# Altium project mwh618.prjpcb (part 1 of 2)
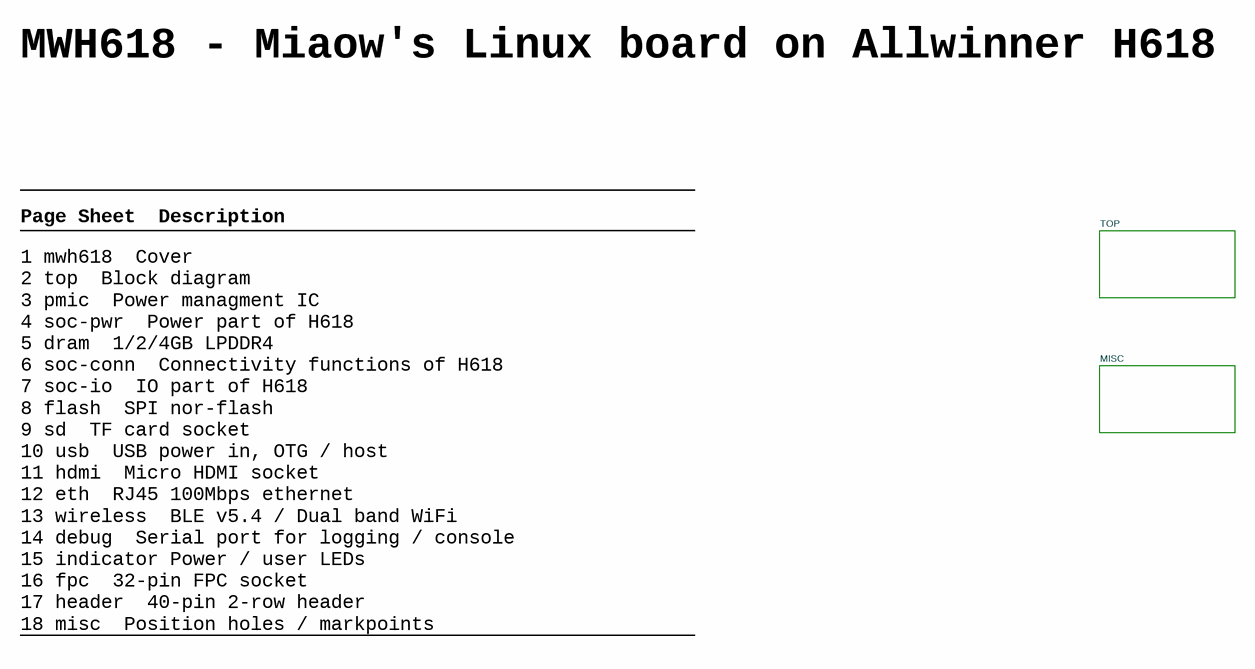
[diagram p0: mwh618.schdoc]
Board: MWH618; License: CERN-OHL-S-2.0 license; Sample: A0; Url: github.com/miaow-cn/mwh618-hw
18 sheets, 304 parts. Net scope: hierarchical (ports join the sheet entries above them; power ports are global).
Board file: mwh618.pcbdoc
Sheets:
  mwh618.schdoc
    TOP = top.schdoc
      LPDDR4 = dram.schdoc
      HDMI = hdmi.schdoc
      PMIC = pmic.schdoc
      SOC-CONN = soc-conn.schdoc
      SOC-PWR = soc-pwr.schdoc
      USB = usb.schdoc
      SOC-IO = soc-io.schdoc
      DEBUG = debug.schdoc
      ETH = eth.schdoc
      SD = sd.schdoc
      FLASH = flash.schdoc
      WIRELESS = wireless.schdoc
      FPC = fpc.schdoc
      HEADER = header.schdoc
      INDICATOR = indicator.schdoc
    MISC = misc.schdoc

## Sheet mwh618.schdoc: MWH618
size A4; Date: 02.10.2025; CheckedBy: BCY; DrawnBy: miaow; Revision: v1.0.0; SheetNumber: 1; SheetTotal: 18; BoardType: MAIN_PCB; Desc: miaow's h618 linux development board

### Sub-sheets
MISC = misc.schdoc: no entries
TOP = top.schdoc: no entries

### Notes on the sheet
- MWH618 - Miaow's Linux board on Allwinner H618
- Page	Sheet		Description
- 1	mwh618		Cover
  2	top		Block diagram
  3	pmic		Power managment IC
  4	soc-pwr		Power part of H618
  5	dram		1/2/4GB LPDDR4
  6	soc-conn		Connectivity functions of H618
  7	soc-io		IO part of H618
  8	flash		SPI nor-flash
  9	sd		TF card socket
  10	usb		USB power in, OTG / host
  11	hdmi		Micro HDMI socket
  12	eth		RJ45 100Mbps ethernet
  13	wireless		BLE v5.4 / Dual band WiFi
  14	debug		Serial port for logging / console
  15	indicator	Power / user LEDs
  16	fpc		32-pin FPC socket
  17	header		40-pin 2-row header
  18	misc		Position holes / markpoints
- DRAWN
- CHECKED
- DRAWNBY
- SHEETS
- SHEETS_NO

## Sheet top.schdoc: MWH618
size A4; Date: 10.01.2026; CheckedBy: BCY; DrawnBy: miaow; Revision: v1.0.0; SheetNumber: 2; SheetTotal: 17; BoardType: MAIN_PCB; Desc: the top level sch
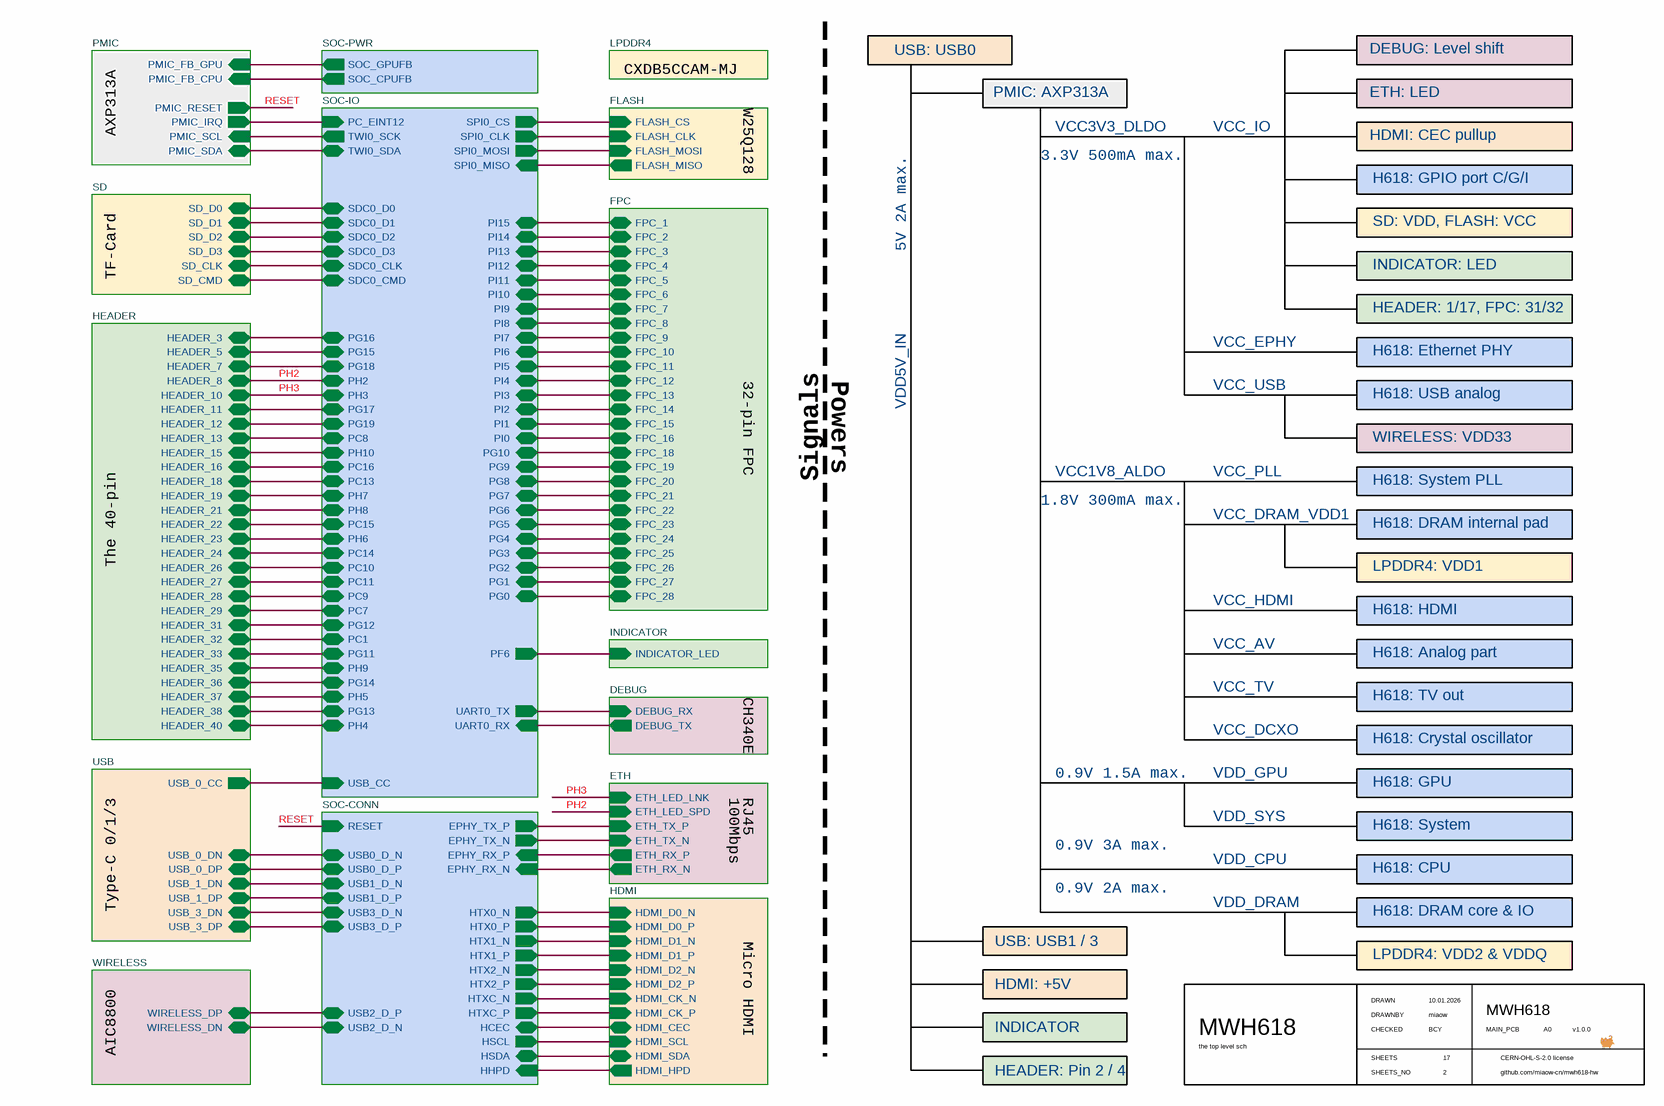
[diagram p1: top.schdoc]

### Sub-sheets
DEBUG = debug.schdoc: DEBUG_TX (out), DEBUG_RX (in)
ETH = eth.schdoc: ETH_TX_P (in), ETH_TX_N (in), ETH_RX_N (out), ETH_RX_P (out), ETH_LED_SPD (in), ETH_LED_LNK (in)
FLASH = flash.schdoc: FLASH_CS (in), FLASH_MISO (out), FLASH_MOSI (in), FLASH_CLK (in)
FPC = fpc.schdoc: FPC_4 (bidir), FPC_5 (bidir), FPC_6 (bidir), FPC_7 (bidir), FPC_8 (bidir), FPC_9 (bidir), FPC_10 (bidir), FPC_11 (bidir), FPC_12 (bidir), FPC_13 (bidir), FPC_14 (bidir), FPC_15 (bidir), FPC_16 (bidir), FPC_22 (bidir), FPC_23 (bidir), FPC_24 (bidir), FPC_25 (bidir), FPC_26 (bidir), FPC_27 (bidir), FPC_28 (bidir), FPC_1 (bidir), FPC_3 (bidir), FPC_2 (bidir), FPC_18 (bidir), FPC_19 (bidir), FPC_20 (bidir), FPC_21 (bidir)
HDMI = hdmi.schdoc: HDMI_D0_N (in), HDMI_D0_P (in), HDMI_D1_N (in), HDMI_D1_P (in), HDMI_D2_N (in), HDMI_D2_P (in), HDMI_CEC (bidir), HDMI_SCL (in), HDMI_SDA (bidir), HDMI_HPD (out), HDMI_CK_N (in), HDMI_CK_P (in)
HEADER = header.schdoc: HEADER_3 (bidir), HEADER_5 (bidir), HEADER_7 (bidir), HEADER_8 (bidir), HEADER_10 (bidir), HEADER_11 (bidir), HEADER_12 (bidir), HEADER_13 (bidir), HEADER_15 (bidir), HEADER_16 (bidir), HEADER_18 (bidir), HEADER_19 (bidir), HEADER_21 (bidir), HEADER_22 (bidir), HEADER_23 (bidir), HEADER_24 (bidir), HEADER_26 (bidir), HEADER_27 (bidir), HEADER_28 (bidir), HEADER_29 (bidir), HEADER_31 (bidir), HEADER_32 (bidir), HEADER_33 (bidir), HEADER_35 (bidir), HEADER_36 (bidir), HEADER_37 (bidir), HEADER_38 (bidir), HEADER_40 (bidir)
INDICATOR = indicator.schdoc: INDICATOR_LED (in)
LPDDR4 = dram.schdoc: no entries
PMIC = pmic.schdoc: PMIC_FB_GPU (in), PMIC_FB_CPU (in), PMIC_SDA (bidir), PMIC_SCL (in), PMIC_IRQ (out), PMIC_RESET (out)
SD = sd.schdoc: SD_D0 (bidir), SD_D1 (bidir), SD_CLK (bidir), SD_D2 (bidir), SD_D3 (bidir), SD_CMD (bidir)
SOC-CONN = soc-conn.schdoc: HHPD (in), HSDA (bidir), HSCL (out), HCEC (bidir), HTXC_P (out), HTXC_N (out), HTX2_P (out), HTX2_N (out), HTX1_P (out), HTX1_N (out), HTX0_P (out), HTX0_N (out), EPHY_RX_N (in), EPHY_RX_P (in), EPHY_TX_N (out), EPHY_TX_P (out), USB2_D_P (bidir), USB2_D_N (bidir), USB3_D_P (bidir), USB3_D_N (bidir), USB1_D_P (bidir), USB1_D_N (bidir), USB0_D_P (bidir), USB0_D_N (bidir), RESET (in)
SOC-IO = soc-io.schdoc: UART0_RX (in), UART0_TX (out), PC_EINT12 (in), TWI0_SDA (bidir), TWI0_SCK (out), SDC0_D1 (bidir), SDC0_D2 (bidir), SDC0_D0 (bidir), SDC0_D3 (bidir), SDC0_CLK (bidir), SDC0_CMD (bidir), PG16 (bidir), PG15 (bidir), PG18 (bidir), PG17 (bidir), PG19 (bidir), PC8 (bidir), PH10 (bidir), PC16 (bidir), PC13 (bidir), PH7 (bidir), PH8 (bidir), PC15 (bidir), PH6 (bidir), PC14 (bidir), PC10 (bidir), PC11 (bidir), PC9 (bidir), PC7 (bidir), PG12 (bidir), USB_CC (in), PF6 (out), PC1 (bidir), PG11 (bidir), PH9 (bidir), PG14 (bidir), PH5 (bidir), PG13 (bidir), PH4 (bidir), SPI0_CS (out), SPI0_CLK (out), SPI0_MOSI (out), SPI0_MISO (in), PI15 (bidir), PI14 (bidir), PI13 (bidir), PI12 (bidir), PI11 (bidir), PI10 (bidir), PI9 (bidir), PI8 (bidir), PI7 (bidir), PI6 (bidir), PI4 (bidir), PI5 (bidir), PI3 (bidir), PI2 (bidir), PI1 (bidir), PI0 (bidir), PG10 (bidir), PG9 (bidir), PG8 (bidir), PG7 (bidir), PG6 (bidir), PG5 (bidir), PG4 (bidir), PG0 (bidir), PG3 (bidir), PG2 (bidir), PG1 (bidir), PH2 (bidir), PH3 (bidir)
SOC-PWR = soc-pwr.schdoc: SOC_GPUFB (out), SOC_CPUFB (out)
USB = usb.schdoc: USB_0_DN (bidir), USB_0_DP (bidir), USB_1_DN (bidir), USB_1_DP (bidir), USB_3_DN (bidir), USB_3_DP (bidir), USB_0_CC (out)
WIRELESS = wireless.schdoc: WIRELESS_DN (bidir), WIRELESS_DP (bidir)

### Nets
_H_3: sheet SOC-IO/PG16, sheet HEADER/HEADER_3
_H_5: sheet SOC-IO/PG15, sheet HEADER/HEADER_5
_H_7: sheet SOC-IO/PG18, sheet HEADER/HEADER_7
_H_11: sheet SOC-IO/PG17, sheet HEADER/HEADER_11
_H_12: sheet SOC-IO/PG19, sheet HEADER/HEADER_12
_H_13: sheet SOC-IO/PC8, sheet HEADER/HEADER_13
_H_15: sheet SOC-IO/PH10, sheet HEADER/HEADER_15
_H_16: sheet SOC-IO/PC16, sheet HEADER/HEADER_16
_H_18: sheet SOC-IO/PC13, sheet HEADER/HEADER_18
_H_19: sheet SOC-IO/PH7, sheet HEADER/HEADER_19
_H_21: sheet SOC-IO/PH8, sheet HEADER/HEADER_21
_H_22: sheet SOC-IO/PC15, sheet HEADER/HEADER_22
_H_23: sheet SOC-IO/PH6, sheet HEADER/HEADER_23
_H_24: sheet SOC-IO/PC14, sheet HEADER/HEADER_24
_H_26: sheet SOC-IO/PC10, sheet HEADER/HEADER_26
_H_27: sheet SOC-IO/PC11, sheet HEADER/HEADER_27
_H_28: sheet SOC-IO/PC9, sheet HEADER/HEADER_28
_H_29: sheet SOC-IO/PC7, sheet HEADER/HEADER_29
_H_31: sheet SOC-IO/PG12, sheet HEADER/HEADER_31
_H_32: sheet SOC-IO/PC1, sheet HEADER/HEADER_32
_H_33: sheet SOC-IO/PG11, sheet HEADER/HEADER_33
_H_35: sheet SOC-IO/PH9, sheet HEADER/HEADER_35
_H_36: sheet SOC-IO/PG14, sheet HEADER/HEADER_36
_H_37: sheet SOC-IO/PH5, sheet HEADER/HEADER_37
_H_38: sheet SOC-IO/PG13, sheet HEADER/HEADER_38
_H_40: sheet SOC-IO/PH4, sheet HEADER/HEADER_40
DEBUG_RX: sheet SOC-IO/UART0_TX, sheet DEBUG/DEBUG_RX
DEBUG_TX: sheet SOC-IO/UART0_RX, sheet DEBUG/DEBUG_TX
EPHY_RX_N: sheet SOC-CONN/EPHY_RX_N, sheet ETH/ETH_RX_N
EPHY_RX_P: sheet SOC-CONN/EPHY_RX_P, sheet ETH/ETH_RX_P
EPHY_TX_N: sheet SOC-CONN/EPHY_TX_N, sheet ETH/ETH_TX_N
EPHY_TX_P: sheet SOC-CONN/EPHY_TX_P, sheet ETH/ETH_TX_P
FLASH_CLK: sheet SOC-IO/SPI0_CLK, sheet FLASH/FLASH_CLK
FLASH_CS: sheet SOC-IO/SPI0_CS, sheet FLASH/FLASH_CS
FLASH_MISO: sheet SOC-IO/SPI0_MISO, sheet FLASH/FLASH_MISO
FLASH_MOSI: sheet SOC-IO/SPI0_MOSI, sheet FLASH/FLASH_MOSI
FPC_1: sheet SOC-IO/PI15, sheet FPC/FPC_1
FPC_2: sheet SOC-IO/PI14, sheet FPC/FPC_2
FPC_3: sheet SOC-IO/PI13, sheet FPC/FPC_3
FPC_4: sheet SOC-IO/PI12, sheet FPC/FPC_4
FPC_5: sheet SOC-IO/PI11, sheet FPC/FPC_5
FPC_6: sheet SOC-IO/PI10, sheet FPC/FPC_6
FPC_7: sheet SOC-IO/PI9, sheet FPC/FPC_7
FPC_8: sheet SOC-IO/PI8, sheet FPC/FPC_8
FPC_9: sheet SOC-IO/PI7, sheet FPC/FPC_9
FPC_10: sheet SOC-IO/PI6, sheet FPC/FPC_10
FPC_11: sheet SOC-IO/PI5, sheet FPC/FPC_11
FPC_12: sheet SOC-IO/PI4, sheet FPC/FPC_12
FPC_13: sheet SOC-IO/PI3, sheet FPC/FPC_13
FPC_14: sheet SOC-IO/PI2, sheet FPC/FPC_14
FPC_15: sheet SOC-IO/PI1, sheet FPC/FPC_15
FPC_16: sheet SOC-IO/PI0, sheet FPC/FPC_16
FPC_18: sheet SOC-IO/PG10, sheet FPC/FPC_18
FPC_19: sheet SOC-IO/PG9, sheet FPC/FPC_19
FPC_20: sheet SOC-IO/PG8, sheet FPC/FPC_20
FPC_21: sheet SOC-IO/PG7, sheet FPC/FPC_21
FPC_22: sheet SOC-IO/PG6, sheet FPC/FPC_22
FPC_23: sheet SOC-IO/PG5, sheet FPC/FPC_23
FPC_24: sheet SOC-IO/PG4, sheet FPC/FPC_24
FPC_25: sheet SOC-IO/PG3, sheet FPC/FPC_25
FPC_26: sheet SOC-IO/PG2, sheet FPC/FPC_26
FPC_27: sheet SOC-IO/PG1, sheet FPC/FPC_27
FPC_28: sheet SOC-IO/PG0, sheet FPC/FPC_28
HCEC: sheet HDMI/HDMI_CEC, sheet SOC-CONN/HCEC
HDMI_CK_N: sheet HDMI/HDMI_CK_N, sheet SOC-CONN/HTXC_N
HDMI_CK_P: sheet HDMI/HDMI_CK_P, sheet SOC-CONN/HTXC_P
HDMI_D0_N: sheet HDMI/HDMI_D0_N, sheet SOC-CONN/HTX0_N
HDMI_D0_P: sheet HDMI/HDMI_D0_P, sheet SOC-CONN/HTX0_P
HDMI_D1_N: sheet HDMI/HDMI_D1_N, sheet SOC-CONN/HTX1_N
HDMI_D1_P: sheet HDMI/HDMI_D1_P, sheet SOC-CONN/HTX1_P
HDMI_D2_N: sheet HDMI/HDMI_D2_N, sheet SOC-CONN/HTX2_N
HDMI_D2_P: sheet HDMI/HDMI_D2_P, sheet SOC-CONN/HTX2_P
HDMI_HPD: sheet HDMI/HDMI_HPD, sheet SOC-CONN/HHPD
HDMI_SCL: sheet HDMI/HDMI_SCL, sheet SOC-CONN/HSCL
HDMI_SDA: sheet HDMI/HDMI_SDA, sheet SOC-CONN/HSDA
INDICATOR_LED: sheet SOC-IO/PF6, sheet INDICATOR/INDICATOR_LED
PC_EINT12: sheet PMIC/PMIC_IRQ, sheet SOC-IO/PC_EINT12
PH2: sheet SOC-IO/PH2, sheet ETH/ETH_LED_SPD, sheet HEADER/HEADER_8
PH3: sheet SOC-IO/PH3, sheet ETH/ETH_LED_LNK, sheet HEADER/HEADER_10
PMIC_FB_CPU: sheet PMIC/PMIC_FB_CPU, sheet SOC-PWR/SOC_CPUFB
PMIC_FB_GPU: sheet PMIC/PMIC_FB_GPU, sheet SOC-PWR/SOC_GPUFB
PMIC_SCL: sheet PMIC/PMIC_SCL, sheet SOC-IO/TWI0_SCK
PMIC_SDA: sheet PMIC/PMIC_SDA, sheet SOC-IO/TWI0_SDA
RESET: sheet PMIC/PMIC_RESET, sheet SOC-CONN/RESET
SD_CLK: sheet SOC-IO/SDC0_CLK, sheet SD/SD_CLK
SD_CMD: sheet SOC-IO/SDC0_CMD, sheet SD/SD_CMD
SD_D0: sheet SOC-IO/SDC0_D0, sheet SD/SD_D0
SD_D1: sheet SOC-IO/SDC0_D1, sheet SD/SD_D1
SD_D2: sheet SOC-IO/SDC0_D2, sheet SD/SD_D2
SD_D3: sheet SOC-IO/SDC0_D3, sheet SD/SD_D3
USB0_D_N: sheet SOC-CONN/USB0_D_N, sheet USB/USB_0_DN
USB0_D_P: sheet SOC-CONN/USB0_D_P, sheet USB/USB_0_DP
USB1_D_N: sheet SOC-CONN/USB1_D_N, sheet USB/USB_1_DN
USB1_D_P: sheet SOC-CONN/USB1_D_P, sheet USB/USB_1_DP
USB2_D_N: sheet SOC-CONN/USB2_D_N, sheet WIRELESS/WIRELESS_DN
USB2_D_P: sheet SOC-CONN/USB2_D_P, sheet WIRELESS/WIRELESS_DP
USB3_D_N: sheet SOC-CONN/USB3_D_N, sheet USB/USB_3_DN
USB3_D_P: sheet SOC-CONN/USB3_D_P, sheet USB/USB_3_DP
USB_0_CC: sheet USB/USB_0_CC, sheet SOC-IO/USB_CC

### Notes on the sheet
- CXDB5CCAM-MJ
- W25Q128
- USB: USB0
- PMIC: AXP313A
- ETH: LED
- DEBUG: Level shift
- AXP313A
- 3.3V 500mA max.
- VCC3V3_DLDO
- VCC_IO
- HDMI: CEC pullup
- H618: GPIO port C/G/I
- 5V 2A max.
- SD: VDD, FLASH: VCC
- TF-Card
- INDICATOR: LED
- HEADER: 1/17, FPC: 31/32
- 32-pin FPC
- Powers
- VDD5V_IN
- VCC_EPHY
- VCC_USB
- H618: USB analog
- H618: Ethernet PHY
- Signals
- VCC1V8_ALDO
- VCC_PLL
- WIRELESS: VDD33
- 1.8V 300mA max.
- VCC_DRAM_VDD1
- H618: System PLL
- H618: DRAM internal pad
- The 40-pin
- VCC_HDMI
- H618: HDMI
- LPDDR4: VDD1
- CH340E
- VCC_AV
- VCC_TV
- H618: Analog part
- VCC_DCXO
- H618: TV out
- H618: Crystal oscillator
- 100Mbps
- RJ45
- 0.9V 1.5A max.
- VDD_GPU
- VDD_SYS
- H618: System
- H618: GPU
- Type-C 0/1/3
- 0.9V 3A max.
- 0.9V 2A max.
- VDD_CPU
- VDD_DRAM
- H618: CPU
- Micro HDMI
- USB: USB1 / 3
- H618: DRAM core & IO
- LPDDR4: VDD2 & VDDQ
- AIC8800
- HDMI: +5V
- INDICATOR
- HEADER: Pin 2 / 4
- DRAWN
- CHECKED
- DRAWNBY
- SHEETS
- SHEETS_NO

## Sheet dram.schdoc: DRAM
size A4; Date: 02.10.2025; CheckedBy: BCY; DrawnBy: miaow; Revision: v1.0.0; SheetNumber: 5; SheetTotal: 17; BoardType: MAIN_PCB; Desc: LPDDR4
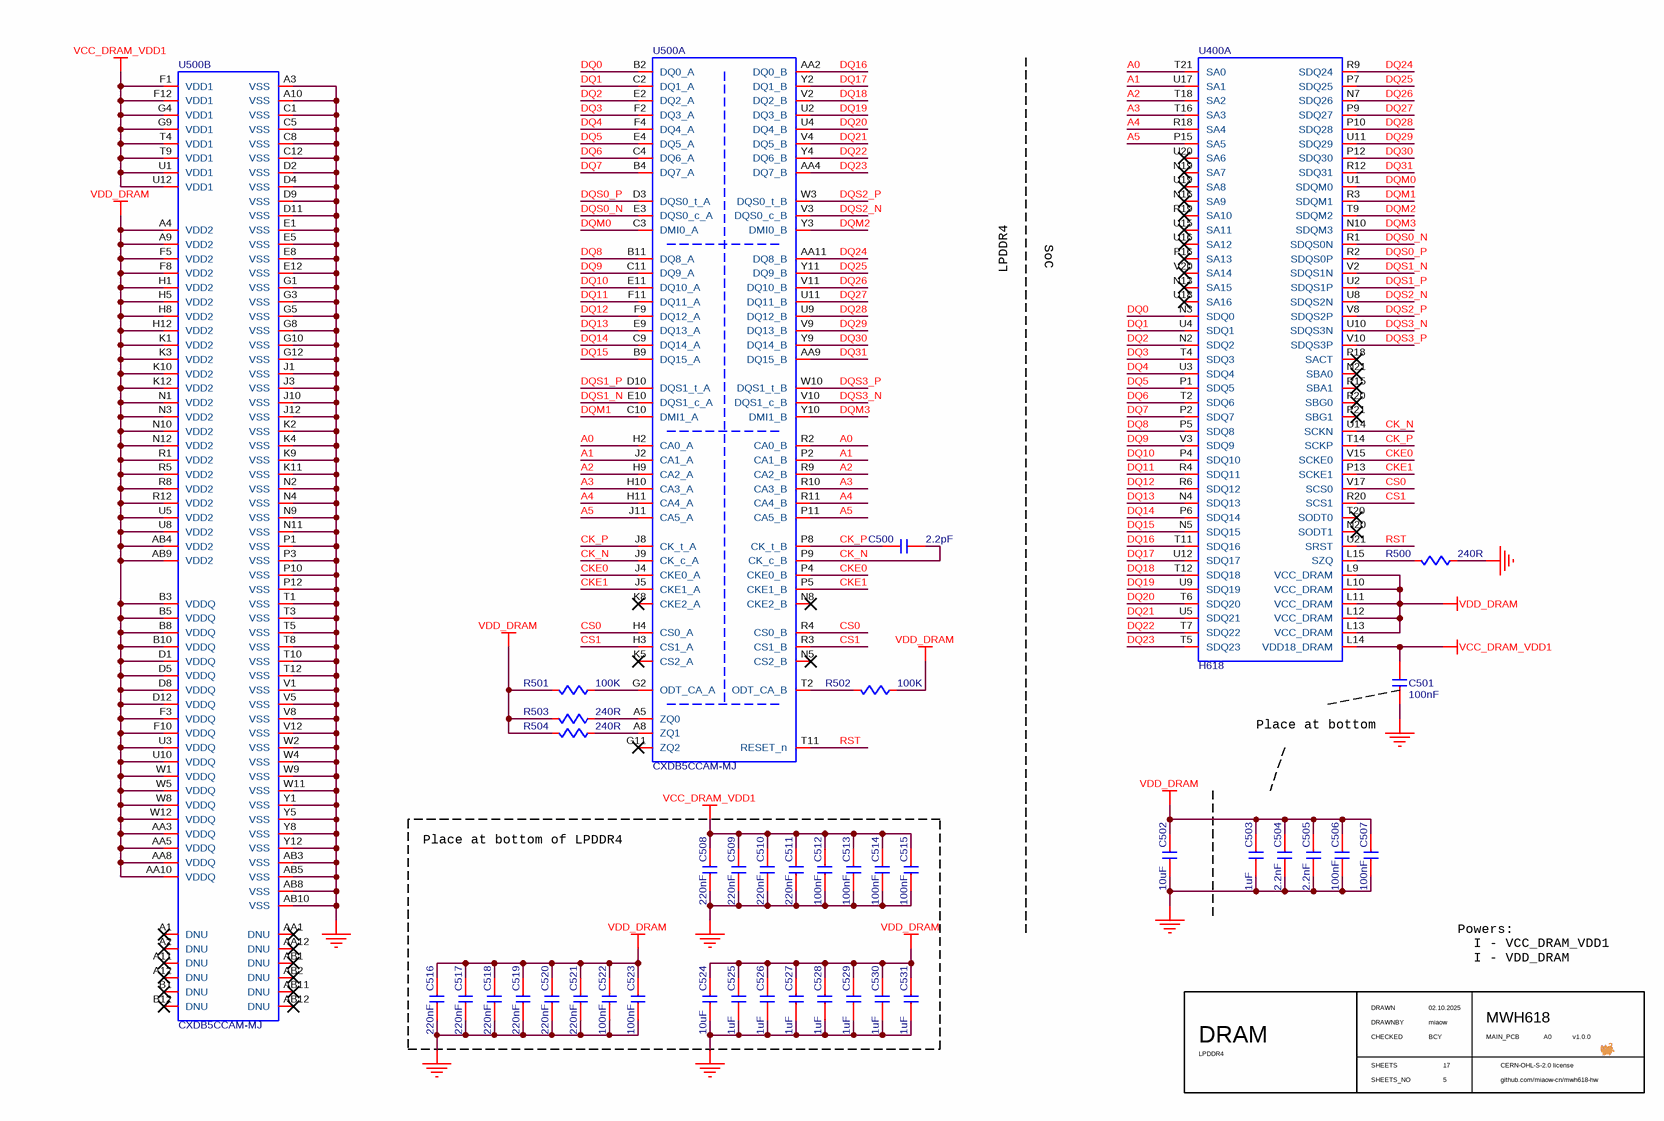
[diagram p2: dram.schdoc]

### Parts
C500  value 2.2pF  [C0201]  (hidden comment: C-NOMO)
C501  value 100nF  [C0201]  (hidden comment: C-NOMO)
C502  value 10uF  [C0402]  (hidden comment: C-NOMO)
C503  value 1uF  [C0201]  (hidden comment: C-NOMO)
C504  value 2.2nF  [C0201]  (hidden comment: C-NOMO)
C505  value 2.2nF  [C0201]  (hidden comment: C-NOMO)
C506  value 100nF  [C0201]  (hidden comment: C-NOMO)
C507  value 100nF  [C0201]  (hidden comment: C-NOMO)
C508  value 220nF  [C0201]  (hidden comment: C-NOMO)
C509  value 220nF  [C0201]  (hidden comment: C-NOMO)
C510  value 220nF  [C0201]  (hidden comment: C-NOMO)
C511  value 220nF  [C0201]  (hidden comment: C-NOMO)
C512  value 100nF  [C0201]  (hidden comment: C-NOMO)
C513  value 100nF  [C0201]  (hidden comment: C-NOMO)
C514  value 100nF  [C0201]  (hidden comment: C-NOMO)
C515  value 100nF  [C0201]  (hidden comment: C-NOMO)
C516  value 220nF  [C0201]  (hidden comment: C-NOMO)
C517  value 220nF  [C0201]  (hidden comment: C-NOMO)
C518  value 220nF  [C0201]  (hidden comment: C-NOMO)
C519  value 220nF  [C0201]  (hidden comment: C-NOMO)
C520  value 220nF  [C0201]  (hidden comment: C-NOMO)
C521  value 220nF  [C0201]  (hidden comment: C-NOMO)
C522  value 100nF  [C0201]  (hidden comment: C-NOMO)
C523  value 100nF  [C0201]  (hidden comment: C-NOMO)
C524  value 10uF  [C0402]  (hidden comment: C-NOMO)
C525  value 1uF  [C0201]  (hidden comment: C-NOMO)
C526  value 1uF  [C0201]  (hidden comment: C-NOMO)
C527  value 1uF  [C0201]  (hidden comment: C-NOMO)
C528  value 1uF  [C0201]  (hidden comment: C-NOMO)
C529  value 1uF  [C0201]  (hidden comment: C-NOMO)
C530  value 1uF  [C0201]  (hidden comment: C-NOMO)
C531  value 1uF  [C0201]  (hidden comment: C-NOMO)
R500  value 240R  [R0402]  (hidden comment: R)
R501  value 100K  [R0402]  (hidden comment: R)
R502  value 100K  [R0402]  (hidden comment: R)
R503  value 240R  [R0402]  (hidden comment: R)
R504  value 240R  [R0402]  (hidden comment: R)
U400  H618  [H618]  (part A of 4)
U500  CXDB5CCAM-MJ  [CXDB5CCAM-MJ]  (parts A,B of 2)

### Blocks framed on the sheet
Place at bottom of LPDDR4: C508-C531

### Nets
GND: C501.1 C502.1 C503.1 C504.1 C505.1 C506.1 C507.1 C508.1 C509.1 C510.1 C511.1 C512.1 C513.1 C514.1 C515.1 C516.1 C517.1 C518.1 C519.1 C520.1 C521.1 C522.1 C523.1 C524.1 C525.1 C526.1 C527.1 C528.1 C529.1 C530.1 C531.1 R500.2 U500.A3(VSS) U500.A10(VSS) U500.AB3(VSS) U500.AB5(VSS) U500.AB8(VSS) U500.AB10(VSS) U500.C1(VSS) U500.C5(VSS) U500.C8(VSS) U500.C12(VSS) U500.D2(VSS) U500.D4(VSS) U500.D9(VSS) U500.D11(VSS) U500.E1(VSS) U500.E5(VSS) U500.E8(VSS) U500.E12(VSS) U500.G1(VSS) U500.G3(VSS) U500.G5(VSS) U500.G8(VSS) U500.G10(VSS) U500.G12(VSS) U500.J1(VSS) U500.J3(VSS) U500.J10(VSS) U500.J12(VSS) U500.K2(VSS) U500.K4(VSS) U500.K9(VSS) U500.K11(VSS) U500.N2(VSS) U500.N4(VSS) U500.N9(VSS) U500.N11(VSS) U500.P1(VSS) U500.P3(VSS) U500.P10(VSS) U500.P12(VSS) U500.T1(VSS) U500.T3(VSS) U500.T5(VSS) U500.T8(VSS) U500.T10(VSS) U500.T12(VSS) U500.V1(VSS) U500.V5(VSS) U500.V8(VSS) U500.V12(VSS) U500.W2(VSS) U500.W4(VSS) U500.W9(VSS) U500.W11(VSS) U500.Y1(VSS) U500.Y5(VSS) U500.Y8(VSS) U500.Y12(VSS)
VCC_DRAM_VDD1: C501.2 C508.2 C509.2 C510.2 C511.2 C512.2 C513.2 C514.2 C515.2 U400.L14(VDD18_DRAM) U500.F1(VDD1) U500.F12(VDD1) U500.G4(VDD1) U500.G9(VDD1) U500.T4(VDD1) U500.T9(VDD1) U500.U1(VDD1) U500.U12(VDD1)  [project net VCC1V8_ALDO]
VDD_DRAM: C502.2 C503.2 C504.2 C505.2 C506.2 C507.2 C516.2 C517.2 C518.2 C519.2 C520.2 C521.2 C522.2 C523.2 C524.2 C525.2 C526.2 C527.2 C528.2 C529.2 C530.2 C531.2 R501.1 R502.2 R503.1 R504.1 U400.L9(VCC_DRAM) U400.L10(VCC_DRAM) U400.L11(VCC_DRAM) U400.L12(VCC_DRAM) U400.L13(VCC_DRAM) U500.A4(VDD2) U500.A9(VDD2) U500.AA3(VDDQ) U500.AA5(VDDQ) U500.AA8(VDDQ) U500.AA10(VDDQ) U500.AB4(VDD2) U500.AB9(VDD2) U500.B3(VDDQ) U500.B5(VDDQ) U500.B8(VDDQ) U500.B10(VDDQ) U500.D1(VDDQ) U500.D5(VDDQ) U500.D8(VDDQ) U500.D12(VDDQ) U500.F3(VDDQ) U500.F5(VDD2) U500.F8(VDD2) U500.F10(VDDQ) U500.H1(VDD2) U500.H5(VDD2) U500.H8(VDD2) U500.H12(VDD2) U500.K1(VDD2) U500.K3(VDD2) U500.K10(VDD2) U500.K12(VDD2) U500.N1(VDD2) U500.N3(VDD2) U500.N10(VDD2) U500.N12(VDD2) U500.R1(VDD2) U500.R5(VDD2) U500.R8(VDD2) U500.R12(VDD2) U500.U3(VDDQ) U500.U5(VDD2) U500.U8(VDD2) U500.U10(VDDQ) U500.W1(VDDQ) U500.W5(VDDQ) U500.W8(VDDQ) U500.W12(VDDQ)
A0: U400.T21(SA0) U500.H2(CA0_A) U500.R2(CA0_B)
A1: U400.U17(SA1) U500.J2(CA1_A) U500.P2(CA1_B)
A2: U400.T18(SA2) U500.H9(CA2_A) U500.R9(CA2_B)
A3: U400.T16(SA3) U500.H10(CA3_A) U500.R10(CA3_B)
A4: U400.R18(SA4) U500.H11(CA4_A) U500.R11(CA4_B)
A5: U400.P15(SA5) U500.J11(CA5_A) U500.P11(CA5_B)
CK_N: C500.1 U400.U14(SCKN) U500.J9(CK_c_A) U500.P9(CK_c_B)
CK_P: C500.2 U400.T14(SCKP) U500.J8(CK_t_A) U500.P8(CK_t_B)
CKE0: U400.V15(SCKE0) U500.J4(CKE0_A) U500.P4(CKE0_B)
CKE1: U400.P13(SCKE1) U500.J5(CKE1_A) U500.P5(CKE1_B)
CS0: U400.V17(SCS0) U500.H4(CS0_A) U500.R4(CS0_B)
CS1: U400.R20(SCS1) U500.H3(CS1_A) U500.R3(CS1_B)
DQ0: U400.N3(SDQ0) U500.B2(DQ0_A)
DQ1: U400.U4(SDQ1) U500.C2(DQ1_A)
DQ2: U400.N2(SDQ2) U500.E2(DQ2_A)
DQ3: U400.T4(SDQ3) U500.F2(DQ3_A)
DQ4: U400.U3(SDQ4) U500.F4(DQ4_A)
DQ5: U400.P1(SDQ5) U500.E4(DQ5_A)
DQ6: U400.T2(SDQ6) U500.C4(DQ6_A)
DQ7: U400.P2(SDQ7) U500.B4(DQ7_A)
DQ8: U400.P5(SDQ8) U500.B11(DQ8_A)
DQ9: U400.V3(SDQ9) U500.C11(DQ9_A)
DQ10: U400.P4(SDQ10) U500.E11(DQ10_A)
DQ11: U400.R4(SDQ11) U500.F11(DQ11_A)
DQ12: U400.R6(SDQ12) U500.F9(DQ12_A)
DQ13: U400.N4(SDQ13) U500.E9(DQ13_A)
DQ14: U400.P6(SDQ14) U500.C9(DQ14_A)
DQ15: U400.N5(SDQ15) U500.B9(DQ15_A)
DQ16: U400.T11(SDQ16) U500.AA2(DQ0_B)
DQ17: U400.U12(SDQ17) U500.Y2(DQ1_B)
DQ18: U400.T12(SDQ18) U500.V2(DQ2_B)
DQ19: U400.U9(SDQ19) U500.U2(DQ3_B)
DQ20: U400.T6(SDQ20) U500.U4(DQ4_B)
DQ21: U400.U5(SDQ21) U500.V4(DQ5_B)
DQ22: U400.T7(SDQ22) U500.Y4(DQ6_B)
DQ23: U400.T5(SDQ23) U500.AA4(DQ7_B)
DQ24: U400.R9(SDQ24) U500.AA11(DQ8_B)
DQ25: U400.P7(SDQ25) U500.Y11(DQ9_B)
DQ26: U400.N7(SDQ26) U500.V11(DQ10_B)
DQ27: U400.P9(SDQ27) U500.U11(DQ11_B)
DQ28: U400.P10(SDQ28) U500.U9(DQ12_B)
DQ29: U400.U11(SDQ29) U500.V9(DQ13_B)
DQ30: U400.P12(SDQ30) U500.Y9(DQ14_B)
DQ31: U400.R12(SDQ31) U500.AA9(DQ15_B)
DQM0: U400.U1(SDQM0) U500.C3(DMI0_A)
DQM1: U400.R3(SDQM1) U500.C10(DMI1_A)
DQM2: U400.T9(SDQM2) U500.Y3(DMI0_B)
DQM3: U400.N10(SDQM3) U500.Y10(DMI1_B)
DQS0_N: U400.R1(SDQS0N) U500.E3(DQS0_c_A)
DQS0_P: U400.R2(SDQS0P) U500.D3(DQS0_t_A)
DQS1_N: U400.V2(SDQS1N) U500.E10(DQS1_c_A)
DQS1_P: U400.U2(SDQS1P) U500.D10(DQS1_t_A)
DQS2_N: U400.U8(SDQS2N) U500.V3(DQS0_c_B)
DQS2_P: U400.V8(SDQS2P) U500.W3(DQS0_t_B)
DQS3_N: U400.U10(SDQS3N) U500.V10(DQS1_c_B)
DQS3_P: U400.V10(SDQS3P) U500.W10(DQS1_t_B)
RST: U400.U21(SRST) U500.T11(RESET_n)
NetR500_1: R500.1 U400.L15(SZQ)
NetR501_2: R501.2 U500.G2(ODT_CA_A)
NetR502_1: R502.1 U500.T2(ODT_CA_B)
NetR503_2: R503.2 U500.A5(ZQ0)
NetR504_2: R504.2 U500.A8(ZQ1)

Not connected (* = marked no-connect by the designer): U400 N13(SA15)* N16(SA9)* N19(SA7)* N20(SODT1)* N21(SBA0)* P16(SA13)* P18(SACT)* P20(SBG0)* P21(SBG1)* R15(SBA1)* R19(SA10)* T20(SODT0)* U15(SA11)* U16(SA12)* U18(SA16)* U19(SA8)* U20(SA6)* V20(SA14)*; U500 A1(DNU)* A2(DNU)* A11(DNU)* A12(DNU)* AA1(DNU)* AA12(DNU)* AB1(DNU)* AB2(DNU)* AB11(DNU)* AB12(DNU)* B1(DNU)* B12(DNU)* G11(ZQ2)* K5(CS2_A)* K8(CKE2_A)* N5(CS2_B)* N8(CKE2_B)*

### Notes on the sheet
- LPDDR4
- SoC
- Place at bottom
- Powers:
  I - VCC_DRAM_VDD1
  I - VDD_DRAM
- DRAWN
- CHECKED
- DRAWNBY
- SHEETS
- SHEETS_NO

### Library data of the parts
C500 = C-NOMO: voltage: 25V; precision: 0.25pF; Supplier 1: LCSC; Supplier Part Number 1: C514586
C501 C506 C507 C512-C515 C522 C523 = C-NOMO: voltage: 10V; precision: 10%; Supplier 1: LCSC; Supplier Part Number 1: C49062
C502 C503 C508-C511 C516-C521 C524-C531 = C-NOMO: voltage: 6.3V; precision: 20%; Supplier 1: LCSC
  C502 C524: Supplier Part Number 1: C15525
  C503 C525-C531: Supplier Part Number 1: C53067
  C508-C511 C516-C521: Supplier Part Number 1: C34696
C504 C505 = C-NOMO: voltage: 50V; precision: 10%; Supplier 1: LCSC; Supplier Part Number 1: C80433
R500-R504 = R: precision: 1%; Supplier 1: LCSC
  R500 R503 R504: Supplier Part Number 1: C2909339
  R501 R502: Supplier Part Number 1: C25741
U400 = H618: SOC; Supplier 1: LCSC; Supplier Part Number 1: C19189292
U500 = CXDB5CCAM-MJ: DDR - LPDDR4; Supplier 1: LCSC; Supplier Part Number 1: C39047067

## Sheet hdmi.schdoc: HDMI
size A4; Date: 09.30.2026; CheckedBy: BCY; DrawnBy: miaow; Revision: v1.0.0; SheetNumber: 11; SheetTotal: 18; BoardType: MAIN_PCB; Desc: Micro / Type D
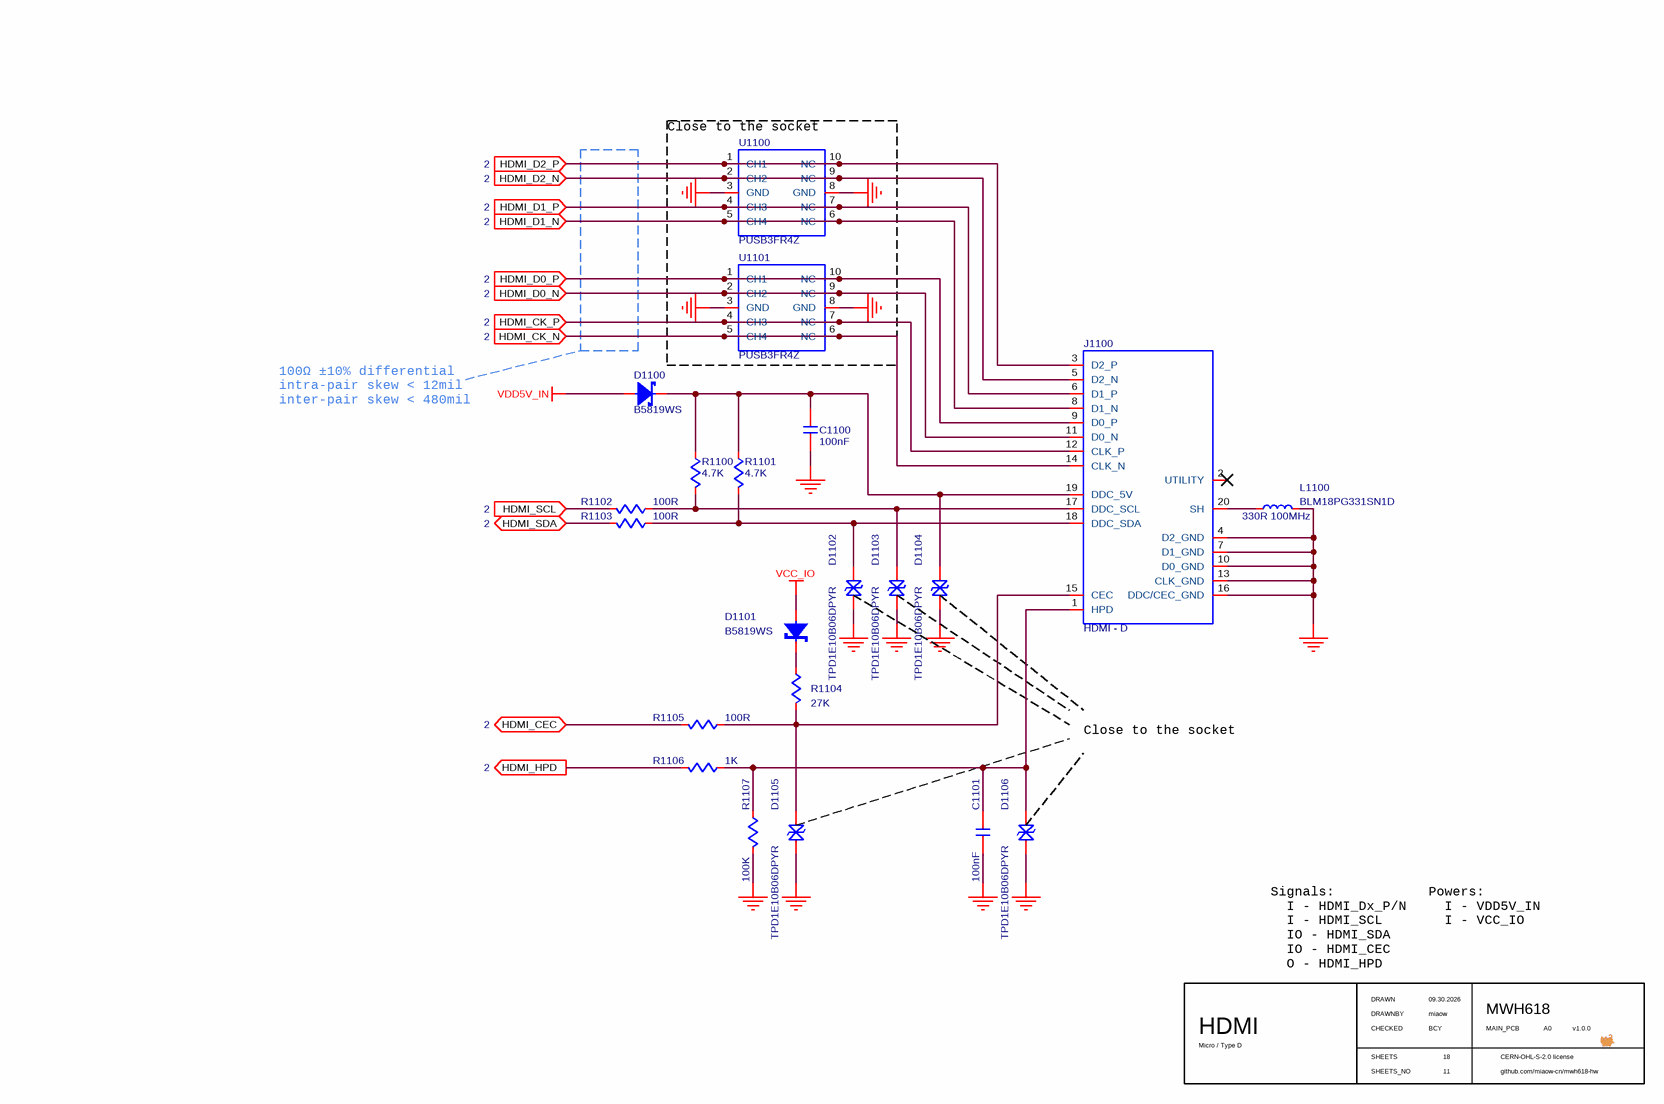
[diagram p3: hdmi.schdoc]

### Parts
C1100  value 100nF  [C0402]  (hidden comment: C-NOMO)
C1101  value 100nF  [C0402]  (hidden comment: C-NOMO)
D1100  B5819WS  [B5819WS]
D1101  B5819WS  [B5819WS]
D1102  TPD1E10B06DPYR  [TPD1E10B06DPYR]
D1103  TPD1E10B06DPYR  [TPD1E10B06DPYR]
D1104  TPD1E10B06DPYR  [TPD1E10B06DPYR]
D1105  TPD1E10B06DPYR  [TPD1E10B06DPYR]
D1106  TPD1E10B06DPYR  [TPD1E10B06DPYR]
J1100  HDMI - D  [HDMI-D]
L1100  BLM18PG331SN1D  value 330R 100MHz  [L0603]
R1100  value 4.7K  [R0402]  (hidden comment: R)
R1101  value 4.7K  [R0402]  (hidden comment: R)
R1102  value 100R  [R0402]  (hidden comment: R)
R1103  value 100R  [R0402]  (hidden comment: R)
R1104  value 27K  [R0402]  (hidden comment: R)
R1105  value 100R  [R0402]  (hidden comment: R)
R1106  value 1K  [R0402]  (hidden comment: R)
R1107  value 100K  [R0402]  (hidden comment: R)
U1100  PUSB3FR4Z  [PUSB3FR4Z]
U1101  PUSB3FR4Z  [PUSB3FR4Z]

### Blocks framed on the sheet
Close to the socket: U1100 U1101

### Ports
HDMI_CEC (bidir, see 2), HDMI_CK_N (in, see 2), HDMI_CK_P (in, see 2), HDMI_D0_N (in, see 2), HDMI_D0_P (in, see 2), HDMI_D1_N (in, see 2), HDMI_D1_P (in, see 2), HDMI_D2_N (in, see 2), HDMI_D2_P (in, see 2), HDMI_HPD (out, see 2), HDMI_SCL (in, see 2), HDMI_SDA (bidir, see 2)

### Nets
GND: C1100.1 C1101.1 D1102.1 D1103.1 D1104.1 D1105.1 D1106.1 J1100.4(D2_GND) J1100.7(D1_GND) J1100.10(D0_GND) J1100.13(CLK_GND) J1100.16(DDC/CEC_GND) L1100.2 R1107.1 U1100.3(GND) U1100.8(GND) U1101.3(GND) U1101.8(GND)
VCC_IO: D1101.2  [project net VCC3V3_DLDO]
VDD5V_IN: D1100.2
HCEC: R1105.1 ; port HDMI_CEC
HDMI_CK_N: J1100.14(CLK_N) U1101.5(CH4) U1101.6(NC) ; port HDMI_CK_N
HDMI_CK_P: J1100.12(CLK_P) U1101.4(CH3) U1101.7(NC) ; port HDMI_CK_P
HDMI_D0_N: J1100.11(D0_N) U1101.2(CH2) U1101.9(NC) ; port HDMI_D0_N
HDMI_D0_P: J1100.9(D0_P) U1101.1(CH1) U1101.10(NC) ; port HDMI_D0_P
HDMI_D1_N: J1100.8(D1_N) U1100.5(CH4) U1100.6(NC) ; port HDMI_D1_N
HDMI_D1_P: J1100.6(D1_P) U1100.4(CH3) U1100.7(NC) ; port HDMI_D1_P
HDMI_D2_N: J1100.5(D2_N) U1100.2(CH2) U1100.9(NC) ; port HDMI_D2_N
HDMI_D2_P: J1100.3(D2_P) U1100.1(CH1) U1100.10(NC) ; port HDMI_D2_P
HDMI_HPD: R1106.1 ; port HDMI_HPD
HDMI_SCL: R1102.1 ; port HDMI_SCL
HDMI_SDA: R1103.1 ; port HDMI_SDA
NetC1100_2: C1100.2 D1100.1 D1104.2 J1100.19(DDC_5V) R1100.2 R1101.2
NetC1101_2: C1101.2 D1106.2 J1100.1(HPD) R1106.2 R1107.2
NetD1101_1: D1101.1 R1104.2
NetD1102_2: D1102.2 J1100.18(DDC_SDA) R1101.1 R1103.2
NetD1103_2: D1103.2 J1100.17(DDC_SCL) R1100.1 R1102.2
NetD1105_2: D1105.2 J1100.15(CEC) R1104.1 R1105.2
NetJ1100_20: J1100.20(SH) L1100.1

Not connected (* = marked no-connect by the designer): J1100 2(UTILITY)*

### Notes on the sheet
- 100Ω ±10% differential
- intra-pair skew < 12mil
- inter-pair skew < 480mil
- Close to the socket
- Signals:
  I - HDMI_Dx_P/N
  I - HDMI_SCL
  IO - HDMI_SDA
  IO - HDMI_CEC
  O - HDMI_HPD
- Powers:
  I - VDD5V_IN
  I - VCC_IO
- DRAWN
- CHECKED
- DRAWNBY
- SHEETS
- SHEETS_NO

### Library data of the parts
C1100 C1101 = C-NOMO: voltage: 50V; precision: 10%; Supplier 1: LCSC; Supplier Part Number 1: C307331
D1100 D1101 = B5819WS: SCHOTTKY; Supplier 1: LCSC; Supplier Part Number 1: C7420331
D1102-D1106 = TPD1E10B06DPYR: TVS/ESD - 1 ch, 5.5V, 6V, 12pF@1MHz, 30KV; Supplier 1: LCSC; Supplier Part Number 1: C48260
J1100 = HDMI: Supplier 1: LCSC; Supplier Part Number 1: C711358
L1100 = L: Code_IEC: 1005; Published: 8-Jun-2000; LatestRevisionDate: 29-May-2009; LatestRevisionNote: IPC-7351 Footprint Added.; PackageReference: 0402-A; Publisher: Altium Limited; PackageDescription: Chip Inductor; Code_JEITA: 0402; Supplier 1: LCSC; Supplier Part Number 1: C79913
R1100-R1107 = R: precision: 1%; Supplier 1: LCSC
  R1100 R1101: Supplier Part Number 1: C25900
  R1102 R1103 R1105: Supplier Part Number 1: C25076
  R1104: Supplier Part Number 1: C25771
  R1106: Supplier Part Number 1: C11702
  R1107: Supplier Part Number 1: C25741
U1100 U1101 = PUSB3FR4Z: TVS/ESD - 4 ch, 3.3V, 5.5V, 0.29pF@1MHz, 15KV; Supplier 1: LCSC; Supplier Part Number 1: C503418

## Sheet pmic.schdoc: PMIC
size A4; Date: 09.27.2026; CheckedBy: BCY; DrawnBy: miaow; Revision: v1.0.0; SheetNumber: 3; SheetTotal: 18; BoardType: MAIN_PCB; Desc: The AXP313A
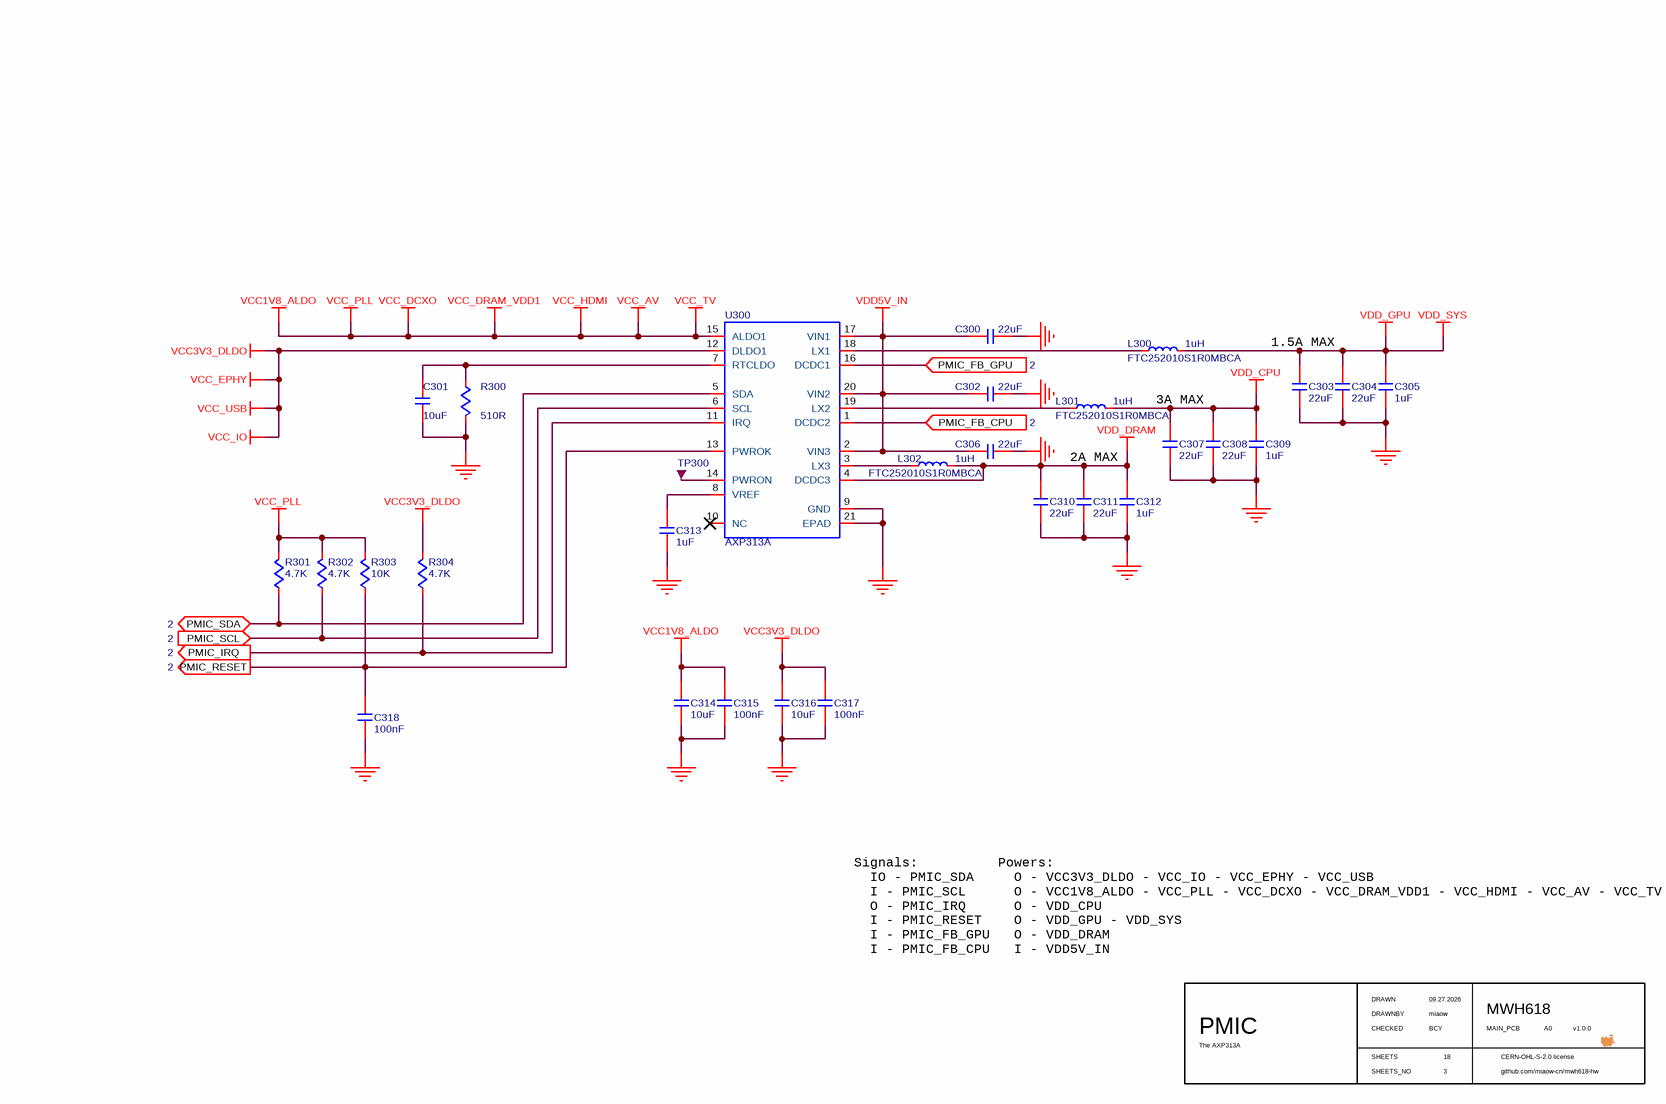
[diagram p4: pmic.schdoc]

### Parts
C300  value 22uF  [C0603]  (hidden comment: C-NOMO)
C301  value 10uF  [C0402]  (hidden comment: C-NOMO)
C302  value 22uF  [C0603]  (hidden comment: C-NOMO)
C303  value 22uF  [C0603]  (hidden comment: C-NOMO)
C304  value 22uF  [C0603]  (hidden comment: C-NOMO)
C305  value 1uF  [C0402]  (hidden comment: C-NOMO)
C306  value 22uF  [C0603]  (hidden comment: C-NOMO)
C307  value 22uF  [C0603]  (hidden comment: C-NOMO)
C308  value 22uF  [C0603]  (hidden comment: C-NOMO)
C309  value 1uF  [C0402]  (hidden comment: C-NOMO)
C310  value 22uF  [C0603]  (hidden comment: C-NOMO)
C311  value 22uF  [C0603]  (hidden comment: C-NOMO)
C312  value 1uF  [C0402]  (hidden comment: C-NOMO)
C313  value 1uF  [C0402]  (hidden comment: C-NOMO)
C314  value 10uF  [C0402]  (hidden comment: C-NOMO)
C315  value 100nF  [C0402]  (hidden comment: C-NOMO)
C316  value 10uF  [C0402]  (hidden comment: C-NOMO)
C317  value 100nF  [C0402]  (hidden comment: C-NOMO)
C318  value 100nF  [C0402]  (hidden comment: C-NOMO)
L300  FTC252010S1R0MBCA  value 1uH  [FTC252010]
L301  FTC252010S1R0MBCA  value 1uH  [FTC252010]
L302  FTC252010S1R0MBCA  value 1uH  [FTC252010]
R300  value 510R  [R0402]  (hidden comment: R)
R301  value 4.7K  [R0402]  (hidden comment: R)
R302  value 4.7K  [R0402]  (hidden comment: R)
R303  value 10K  [R0402]  (hidden comment: R)
R304  value 4.7K  [R0402]  (hidden comment: R)
TP300  TP  [TP]  (value not drawn)
U300  AXP313A  [AXP313A]

### Ports
PMIC_FB_CPU (in, see 2), PMIC_FB_GPU (in, see 2), PMIC_IRQ (out, see 2), PMIC_RESET (out, see 2), PMIC_SCL (in, see 2), PMIC_SDA (bidir, see 2)

### Nets
GND: C300.2 C301.2 C302.2 C303.1 C304.1 C305.1 C306.2 C307.1 C308.1 C309.1 C310.1 C311.1 C312.1 C313.2 C314.2 C315.2 C316.2 C317.2 C318.2 R300.1 U300.9(GND) U300.21(EPAD)
VCC1V8_ALDO: C314.1 C315.1 R301.1 R302.1 R303.1 U300.15(ALDO1)  [also labelled VCC_AV, VCC_DCXO, VCC_DRAM_VDD1, VCC_HDMI, VCC_PLL, VCC_TV]
VCC3V3_DLDO: C316.1 C317.1 R304.1 U300.12(DLDO1)  [also labelled VCC_EPHY, VCC_IO, VCC_USB]
VDD5V_IN: C300.1 C302.1 C306.1 U300.2(VIN3) U300.17(VIN1) U300.20(VIN2)
VDD_CPU: C307.2 C308.2 C309.2 L301.2
VDD_DRAM: C310.2 C311.2 C312.2 L302.2 U300.4(DCDC3)
VDD_GPU: C303.2 C304.2 C305.2 L300.2  [also labelled VDD_SYS]
PC_EINT12: R304.2 U300.11(IRQ) ; port PMIC_IRQ
PMIC_FB_CPU: U300.1(DCDC2) ; port PMIC_FB_CPU
PMIC_FB_GPU: U300.16(DCDC1) ; port PMIC_FB_GPU
PMIC_SCL: R302.2 U300.6(SCL) ; port PMIC_SCL
PMIC_SDA: R301.2 U300.5(SDA) ; port PMIC_SDA
RESET: C318.1 R303.2 U300.13(PWROK) ; port PMIC_RESET
NetC301_1: C301.1 R300.2 U300.7(RTCLDO)
NetC313_1: C313.1 U300.8(VREF)
NetL300_1: L300.1 U300.18(LX1)
NetL301_1: L301.1 U300.19(LX2)
NetL302_1: L302.1 U300.3(LX3)
NetTP300_0: TP300.0 U300.14(PWRON)

Not connected (* = marked no-connect by the designer): U300 10(NC)*

### Notes on the sheet
- 3A MAX
- 1.5A MAX
- 2A MAX
- Signals:
  IO - PMIC_SDA
  I - PMIC_SCL
  O - PMIC_IRQ
  I - PMIC_RESET
  I - PMIC_FB_GPU
  I - PMIC_FB_CPU
- Powers:
  O - VCC3V3_DLDO - VCC_IO - VCC_EPHY - VCC_USB
  O - VCC1V8_ALDO - VCC_PLL - VCC_DCXO - VCC_DRAM_VDD1 - VCC_HDMI - VCC_AV - VCC_TV
  O - VDD_CPU
  O - VDD_GPU - VDD_SYS
  O - VDD_DRAM
  I - VDD5V_IN
- DRAWN
- CHECKED
- DRAWNBY
- SHEETS
- SHEETS_NO

### Library data of the parts
C300 C302-C304 C306-C308 C310 C311 = C-NOMO: voltage: 10V; precision: 20%; Supplier 1: LCSC; Supplier Part Number 1: C2980159
C301 C314 C316 = C-NOMO: voltage: 6.3V; precision: 20%; Supplier 1: LCSC; Supplier Part Number 1: C15525
C305 C309 C312 C313 = C-NOMO: voltage: 25V; precision: 10%; Supplier 1: LCSC; Supplier Part Number 1: C52923
C315 C317 C318 = C-NOMO: voltage: 50V; precision: 10%; Supplier 1: LCSC; Supplier Part Number 1: C307331
L300-L302 = L: Code_IEC: 1005; Published: 8-Jun-2000; LatestRevisionDate: 29-May-2009; LatestRevisionNote: IPC-7351 Footprint Added.; PackageReference: 0402-A; Publisher: Altium Limited; PackageDescription: Chip Inductor; Code_JEITA: 0402
R300-R304 = R: precision: 1%; Supplier 1: LCSC
  R300: Supplier Part Number 1: C25123
  R301 R302 R304: Supplier Part Number 1: C25900
  R303: Supplier Part Number 1: C25744
U300 = AXP313A: PMIC; Supplier 1: LCSC; Supplier Part Number 1: C5365290

## Sheet soc-conn.schdoc: SOC-CONN
size A4; Date: 09.29.2026; CheckedBy: BCY; DrawnBy: miaow; Revision: v1.0.0; SheetNumber: 6; SheetTotal: 18; BoardType: MAIN_PCB; Desc: Conectivity, USB, HDMI, ETH
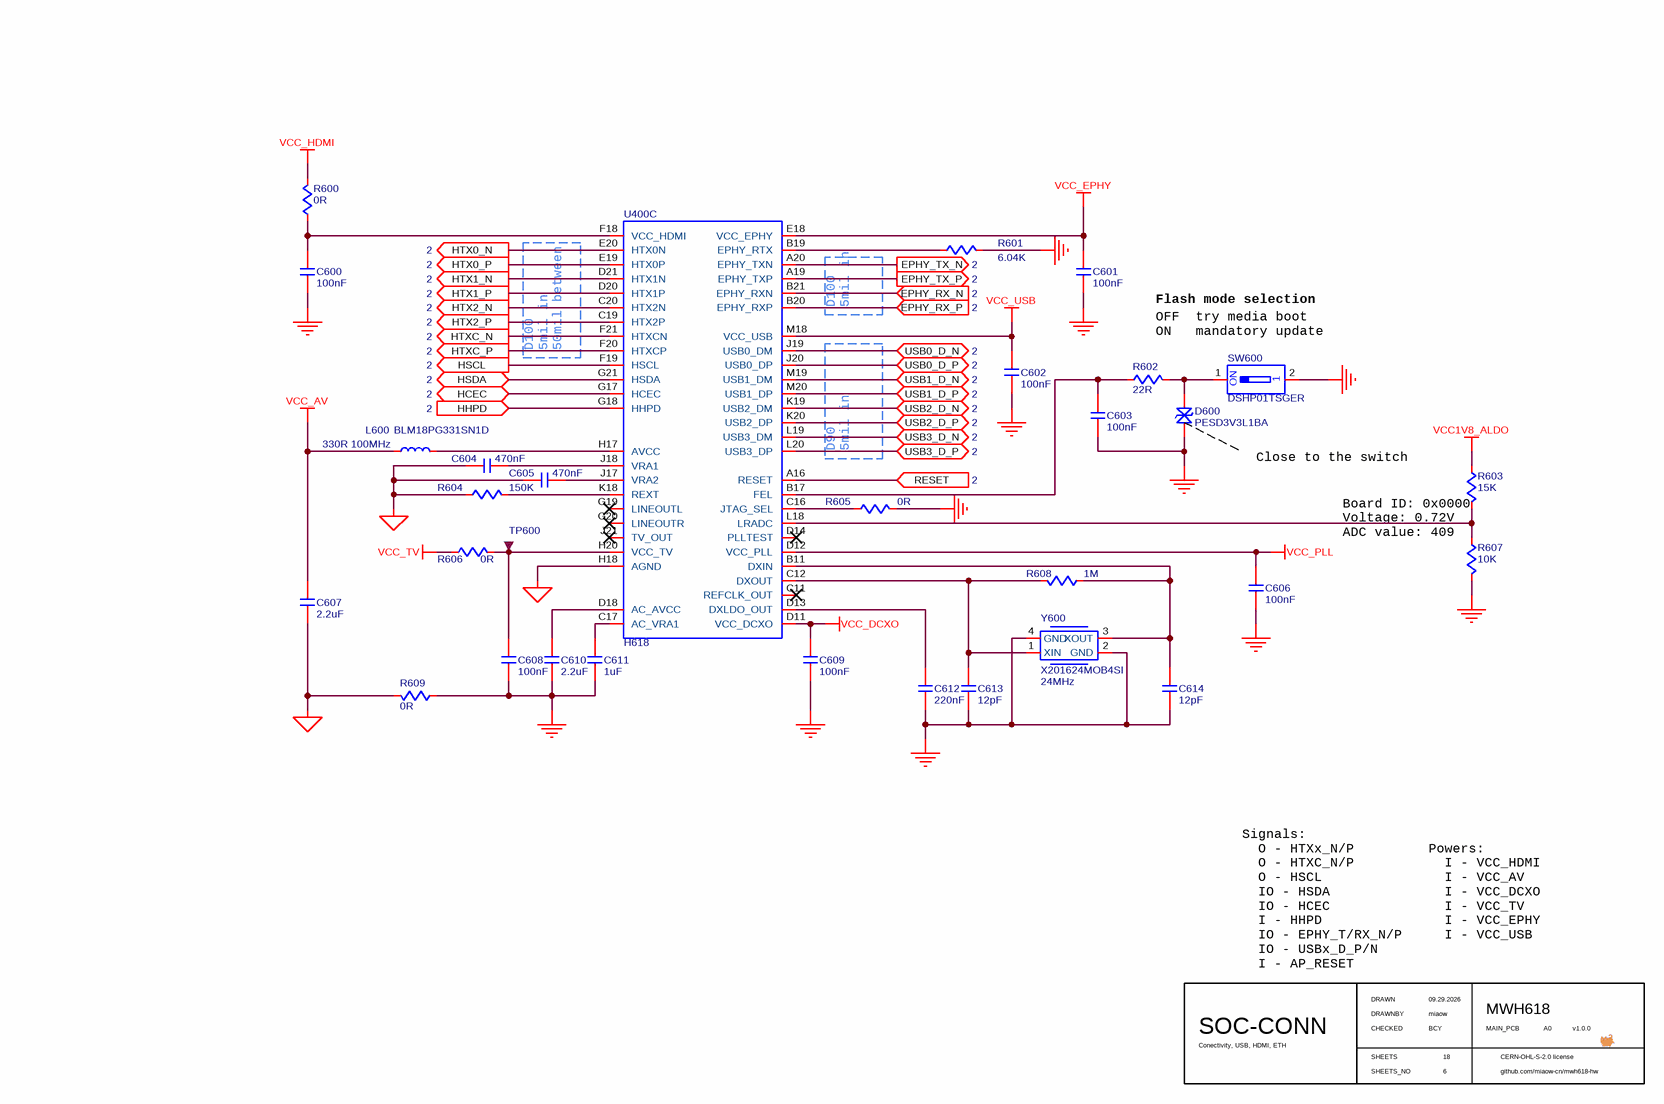
[diagram p5: soc-conn.schdoc]

### Parts
C600  value 100nF  [C0201]  (hidden comment: C-NOMO)
C601  value 100nF  [C0201]  (hidden comment: C-NOMO)
C602  value 100nF  [C0201]  (hidden comment: C-NOMO)
C603  value 100nF  [C0402]  (hidden comment: C-NOMO)
C604  value 470nF  [C0201]  (hidden comment: C-NOMO)
C605  value 470nF  [C0201]  (hidden comment: C-NOMO)
C606  value 100nF  [C0201]  (hidden comment: C-NOMO)
C607  value 2.2uF  [C0402]  (hidden comment: C-NOMO)
C608  value 100nF  [C0201]  (hidden comment: C-NOMO)
C609  value 100nF  [C0201]  (hidden comment: C-NOMO)
C610  value 2.2uF  [C0402]  (hidden comment: C-NOMO)
C611  value 1uF  [C0201]  (hidden comment: C-NOMO)
C612  value 220nF  [C0201]  (hidden comment: C-NOMO)
C613  value 12pF  [C0402]  (hidden comment: C-NOMO)
C614  value 12pF  [C0402]  (hidden comment: C-NOMO)
D600  PESD3V3L1BA  [PESD3V3L1BA]
L600  BLM18PG331SN1D  value 330R 100MHz  [L0603]
R600  value 0R  [R0402]  (hidden comment: R)
R601  value 6.04K  [R0402]  (hidden comment: R)
R602  value 22R  [R0402]  (hidden comment: R)
R603  value 15K  [R0402]  (hidden comment: R)
R604  value 150K  [R0402]  (hidden comment: R)
R605  value 0R  [R0402]  (hidden comment: R)
R606  value 0R  [R0402]  (hidden comment: R)
R607  value 10K  [R0402]  (hidden comment: R)
R608  value 1M  [R0402]  (hidden comment: R)
R609  value 0R  [R0402]  (hidden comment: R)
SW600  DSHP01TSGER  [DSHP01TSGER]
TP600  TP  [TP]  (value not drawn)
U400  H618  [H618]  (part C of 4)
Y600  X201624MOB4SI  value 24MHz  [X201624MOB4SI]

### Ports
EPHY_RX_N (in, see 2), EPHY_RX_P (in, see 2), EPHY_TX_N (out, see 2), EPHY_TX_P (out, see 2), HCEC (bidir, see 2), HHPD (in, see 2), HSCL (out, see 2), HSDA (bidir, see 2), HTX0_N (out, see 2), HTX0_P (out, see 2), HTX1_N (out, see 2), HTX1_P (out, see 2), HTX2_N (out, see 2), HTX2_P (out, see 2), HTXC_N (out, see 2), HTXC_P (out, see 2), RESET (in, see 2), USB0_D_N (bidir, see 2), USB0_D_P (bidir, see 2), USB1_D_N (bidir, see 2), USB1_D_P (bidir, see 2), USB2_D_N (bidir, see 2), USB2_D_P (bidir, see 2), USB3_D_N (bidir, see 2), USB3_D_P (bidir, see 2)

### Nets
AGND: C604.2 C605.2 C607.1 R604.2 R609.1 U400.H18(AGND)
GND: C600.2 C601.2 C602.2 C603.2 C606.2 C608.2 C609.2 C610.1 C611.1 C612.2 C613.2 C614.2 D600.1 R601.1 R605.1 R607.1 R609.2 SW600.2 Y600.2(GND) Y600.4(GND)
VCC1V8_ALDO: C606.1 C607.2 C609.1 L600.1 R600.1 R603.2 R606.2 U400.D11(VCC_DCXO) U400.D12(VCC_PLL)  [also labelled VCC_AV, VCC_DCXO, VCC_HDMI, VCC_PLL, VCC_TV]
VCC_EPHY: C601.1 C602.1 U400.E18(VCC_EPHY) U400.M18(VCC_USB)  [also labelled VCC_USB]  [project net VCC3V3_DLDO]
EPHY_RX_N: U400.B21(EPHY_RXN) ; port EPHY_RX_N
EPHY_RX_P: U400.B20(EPHY_RXP) ; port EPHY_RX_P
EPHY_TX_N: U400.A20(EPHY_TXN) ; port EPHY_TX_N
EPHY_TX_P: U400.A19(EPHY_TXP) ; port EPHY_TX_P
HCEC: U400.G17(HCEC) ; port HCEC
HDMI_CK_N: U400.F21(HTXCN) ; port HTXC_N
HDMI_CK_P: U400.F20(HTXCP) ; port HTXC_P
HDMI_D0_N: U400.E20(HTX0N) ; port HTX0_N
HDMI_D0_P: U400.E19(HTX0P) ; port HTX0_P
HDMI_D1_N: U400.D21(HTX1N) ; port HTX1_N
HDMI_D1_P: U400.D20(HTX1P) ; port HTX1_P
HDMI_D2_N: U400.C20(HTX2N) ; port HTX2_N
HDMI_D2_P: U400.C19(HTX2P) ; port HTX2_P
HDMI_HPD: U400.G18(HHPD) ; port HHPD
HDMI_SCL: U400.F19(HSCL) ; port HSCL
HDMI_SDA: U400.G21(HSDA) ; port HSDA
RESET: U400.A16(RESET) ; port RESET
USB0_D_N: U400.J19(USB0_DM) ; port USB0_D_N
USB0_D_P: U400.J20(USB0_DP) ; port USB0_D_P
USB1_D_N: U400.M19(USB1_DM) ; port USB1_D_N
USB1_D_P: U400.M20(USB1_DP) ; port USB1_D_P
USB2_D_N: U400.K19(USB2_DM) ; port USB2_D_N
USB2_D_P: U400.K20(USB2_DP) ; port USB2_D_P
USB3_D_N: U400.L19(USB3_DM) ; port USB3_D_N
USB3_D_P: U400.L20(USB3_DP) ; port USB3_D_P
NetC600_1: C600.1 R600.2 U400.F18(VCC_HDMI)
NetC603_1: C603.1 R602.2 U400.B17(FEL)
NetC604_1: C604.1 U400.J18(VRA1)
NetC605_1: C605.1 U400.J17(VRA2)
NetC608_1: C608.1 R606.1 TP600.0 U400.H20(VCC_TV)
NetC610_2: C610.2 U400.D18(AC_AVCC)
NetC611_2: C611.2 U400.C17(AC_VRA1)
NetC612_1: C612.1 U400.D13(DXLDO_OUT)
NetC613_1: C613.1 R608.1 U400.C12(DXOUT) Y600.1(XIN)
NetC614_1: C614.1 R608.2 U400.B11(DXIN) Y600.3(XOUT)
NetD600_2: D600.2 R602.1 SW600.1
NetL600_2: L600.2 U400.H17(AVCC)
NetR601_2: R601.2 U400.B19(EPHY_RTX)
NetR603_1: R603.1 R607.2 U400.L18(LRADC)
NetR604_1: R604.1 U400.K18(REXT)
NetR605_2: R605.2 U400.C16(JTAG_SEL)

Not connected (* = marked no-connect by the designer): U400 C11(REFCLK_OUT)* D14(PLLTEST)* G19(LINEOUTL)* G20(LINEOUTR)* J21(TV_OUT)*

### Notes on the sheet
- (near U400) D100
- 5mil in
- Flash mode selection
- OFF  try media boot
  ON   mandatory update
- D100
- 50mil between
- D90
- Close to the switch
- (near R603) Board ID: 0x0000
  Voltage: 0.72V
  ADC value: 409
- Powers:
  I - VCC_HDMI
  I - VCC_AV
  I - VCC_DCXO
  I - VCC_TV
  I - VCC_EPHY
  I - VCC_USB
- Signals:
  O - HTXx_N/P
  O - HTXC_N/P
  O - HSCL
  IO - HSDA
  IO - HCEC
  I - HHPD
  IO - EPHY_T/RX_N/P
  IO - USBx_D_P/N
  I - AP_RESET
- DRAWN
- CHECKED
- DRAWNBY
- SHEETS
- SHEETS_NO
- (in symbol DSHP01TSGER) ON

### Library data of the parts
C600-C602 C606 C608 C609 = C-NOMO: voltage: 10V; precision: 10%; Supplier 1: LCSC; Supplier Part Number 1: C49062
C603 = C-NOMO: voltage: 50V; precision: 10%; Supplier 1: LCSC; Supplier Part Number 1: C307331
C604 C605 C607 C610-C612 = C-NOMO: voltage: 6.3V; precision: 20%; Supplier 1: LCSC
  C604 C605: Supplier Part Number 1: C159817
  C607 C610: Supplier Part Number 1: C12530
  C611: Supplier Part Number 1: C53067
  C612: Supplier Part Number 1: C34696
C613 C614 = C-NOMO: voltage: 50V; precision: 5%; Supplier 1: LCSC; Supplier Part Number 1: C1547
D600 = PESD3V3L1BA: TVS/ESD - 1 ch, 3.3V, 4V, 100pF@1MHz, 30KV; Supplier 1: LCSC; Supplier Part Number 1: C2687129
L600 = L: Code_IEC: 1005; Published: 8-Jun-2000; LatestRevisionDate: 29-May-2009; LatestRevisionNote: IPC-7351 Footprint Added.; PackageReference: 0402-A; Publisher: Altium Limited; PackageDescription: Chip Inductor; Code_JEITA: 0402; Supplier 1: LCSC; Supplier Part Number 1: C79913
R600-R609 = R: precision: 1%; Supplier 1: LCSC
  R600 R605 R606 R609: Supplier Part Number 1: C17168
  R601: Supplier Part Number 1: C25913
  R602: Supplier Part Number 1: C25092
  R603: Supplier Part Number 1: C25756
  R604: Supplier Part Number 1: C25755
  R607: Supplier Part Number 1: C25744
  R608: Supplier Part Number 1: C26083
SW600 = DSHP01TSGER: SWITCH - SPST, 1ch; Supplier 1: LCSC; Supplier Part Number 1: C3293141
U400 = H618: SOC; Supplier 1: LCSC; Supplier Part Number 1: C19189292
Y600 = X201624MOB4SI: XTAL - passive, 24MHz, ±10ppm, 12pF; Supplier 1: LCSC; Supplier Part Number 1: C5210655

## Sheet soc-pwr.schdoc: SOC-PWR
size A4; Date: 09.27.2026; CheckedBy: BCY; DrawnBy: miaow; Revision: v1.0.0; SheetNumber: 4; SheetTotal: 17; BoardType: MAIN_PCB; Desc: Power supply of the H618
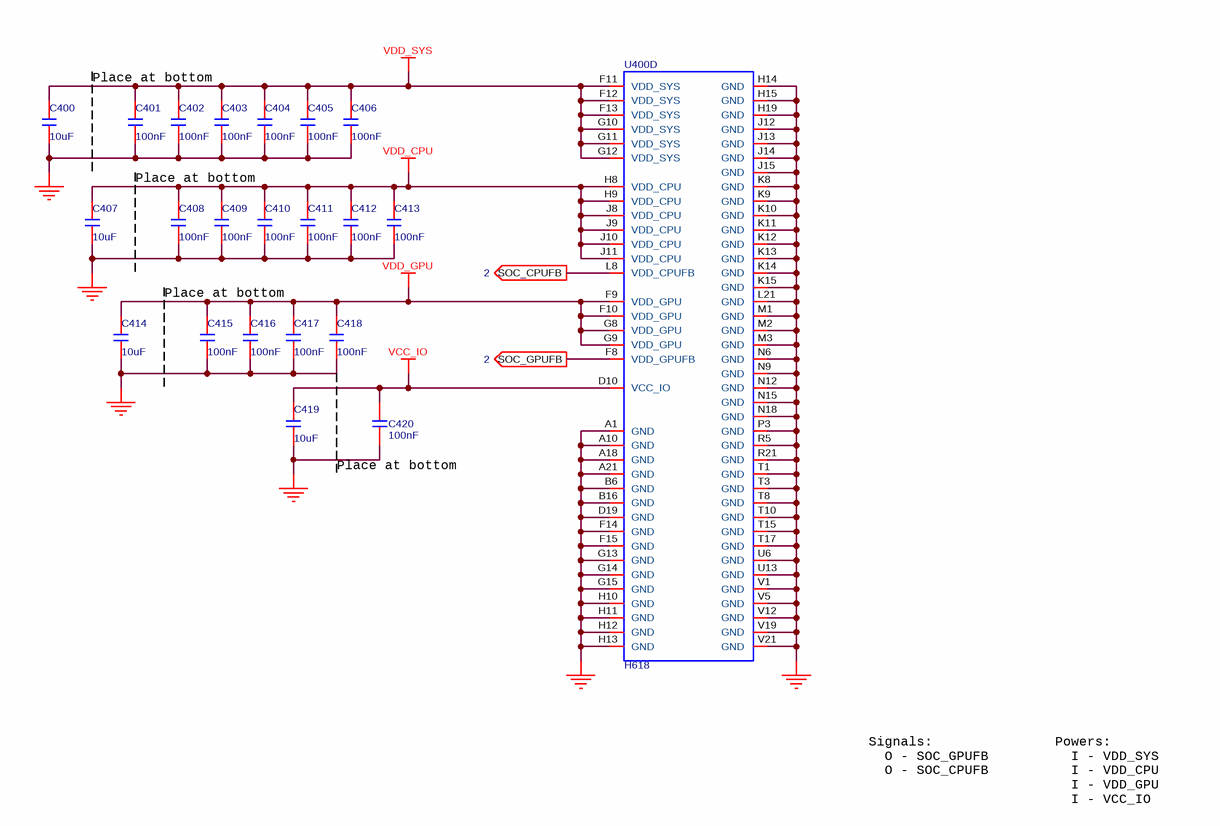
[diagram p6: soc-pwr.schdoc]

### Parts
C400  value 10uF  [C0402]  (hidden comment: C-NOMO)
C401  value 100nF  [C0201]  (hidden comment: C-NOMO)
C402  value 100nF  [C0201]  (hidden comment: C-NOMO)
C403  value 100nF  [C0201]  (hidden comment: C-NOMO)
C404  value 100nF  [C0201]  (hidden comment: C-NOMO)
C405  value 100nF  [C0201]  (hidden comment: C-NOMO)
C406  value 100nF  [C0201]  (hidden comment: C-NOMO)
C407  value 10uF  [C0402]  (hidden comment: C-NOMO)
C408  value 100nF  [C0201]  (hidden comment: C-NOMO)
C409  value 100nF  [C0201]  (hidden comment: C-NOMO)
C410  value 100nF  [C0201]  (hidden comment: C-NOMO)
C411  value 100nF  [C0201]  (hidden comment: C-NOMO)
C412  value 100nF  [C0201]  (hidden comment: C-NOMO)
C413  value 100nF  [C0201]  (hidden comment: C-NOMO)
C414  value 10uF  [C0402]  (hidden comment: C-NOMO)
C415  value 100nF  [C0201]  (hidden comment: C-NOMO)
C416  value 100nF  [C0201]  (hidden comment: C-NOMO)
C417  value 100nF  [C0201]  (hidden comment: C-NOMO)
C418  value 100nF  [C0201]  (hidden comment: C-NOMO)
C419  value 10uF  [C0402]  (hidden comment: C-NOMO)
C420  value 100nF  [C0201]  (hidden comment: C-NOMO)
U400  H618  [H618]  (part D of 4)

### Ports
SOC_CPUFB (out, see 2), SOC_GPUFB (out, see 2)

### Nets
GND: C400.1 C401.1 C402.1 C403.1 C404.1 C405.1 C406.1 C407.1 C408.1 C409.1 C410.1 C411.1 C412.1 C413.1 C414.1 C415.1 C416.1 C417.1 C418.1 C419.1 C420.1 U400.A1(GND) U400.A10(GND) U400.A18(GND) U400.A21(GND) U400.B6(GND) U400.B16(GND) U400.D19(GND) U400.F14(GND) U400.F15(GND) U400.G13(GND) U400.G14(GND) U400.G15(GND) U400.H10(GND) U400.H11(GND) U400.H12(GND) U400.H13(GND) U400.H14(GND) U400.H15(GND) U400.H19(GND) U400.J12(GND) U400.J13(GND) U400.J14(GND) U400.J15(GND) U400.K8(GND) U400.K9(GND) U400.K10(GND) U400.K11(GND) U400.K12(GND) U400.K13(GND) U400.K14(GND) U400.K15(GND) U400.L21(GND) U400.M1(GND) U400.M2(GND) U400.M3(GND) U400.N6(GND) U400.N9(GND) U400.N12(GND) U400.N15(GND) U400.N18(GND) U400.P3(GND) U400.R5(GND) U400.R21(GND) U400.T1(GND) U400.T3(GND) U400.T8(GND) U400.T10(GND) U400.T15(GND) U400.T17(GND) U400.U6(GND) U400.U13(GND) U400.V1(GND) U400.V5(GND) U400.V12(GND) U400.V19(GND) U400.V21(GND)
VCC_IO: C419.2 C420.2 U400.D10(VCC_IO)  [project net VCC3V3_DLDO]
VDD_CPU: C407.2 C408.2 C409.2 C410.2 C411.2 C412.2 C413.2 U400.H8(VDD_CPU) U400.H9(VDD_CPU) U400.J8(VDD_CPU) U400.J9(VDD_CPU) U400.J10(VDD_CPU) U400.J11(VDD_CPU)
VDD_GPU: C400.2 C401.2 C402.2 C403.2 C404.2 C405.2 C406.2 C414.2 C415.2 C416.2 C417.2 C418.2 U400.F9(VDD_GPU) U400.F10(VDD_GPU) U400.F11(VDD_SYS) U400.F12(VDD_SYS) U400.F13(VDD_SYS) U400.G8(VDD_GPU) U400.G9(VDD_GPU) U400.G10(VDD_SYS) U400.G11(VDD_SYS) U400.G12(VDD_SYS)  [also labelled VDD_SYS]
PMIC_FB_CPU: U400.L8(VDD_CPUFB) ; port SOC_CPUFB
PMIC_FB_GPU: U400.F8(VDD_GPUFB) ; port SOC_GPUFB

### Notes on the sheet
- Place at bottom
- (near C420) Place at bottom
- Signals:
  O - SOC_GPUFB
  O - SOC_CPUFB
- Powers:
  I - VDD_SYS
  I - VDD_CPU
  I - VDD_GPU
  I - VCC_IO
- DRAWN
- CHECKED
- DRAWNBY
- SHEETS
- SHEETS_NO

### Library data of the parts
C400 C407 C414 C419 = C-NOMO: voltage: 6.3V; precision: 20%; Supplier 1: LCSC; Supplier Part Number 1: C15525
C401-C406 C408-C413 C415-C418 C420 = C-NOMO: voltage: 10V; precision: 10%; Supplier 1: LCSC; Supplier Part Number 1: C49062
U400 = H618: SOC; Supplier 1: LCSC; Supplier Part Number 1: C19189292

## Sheet usb.schdoc: USB
size A4; Date: 09.30.2026; CheckedBy: BCY; DrawnBy: miaow; Revision: v1.0.0; SheetNumber: 10; SheetTotal: 18; BoardType: MAIN_PCB; Desc: Power in & USB 0/1
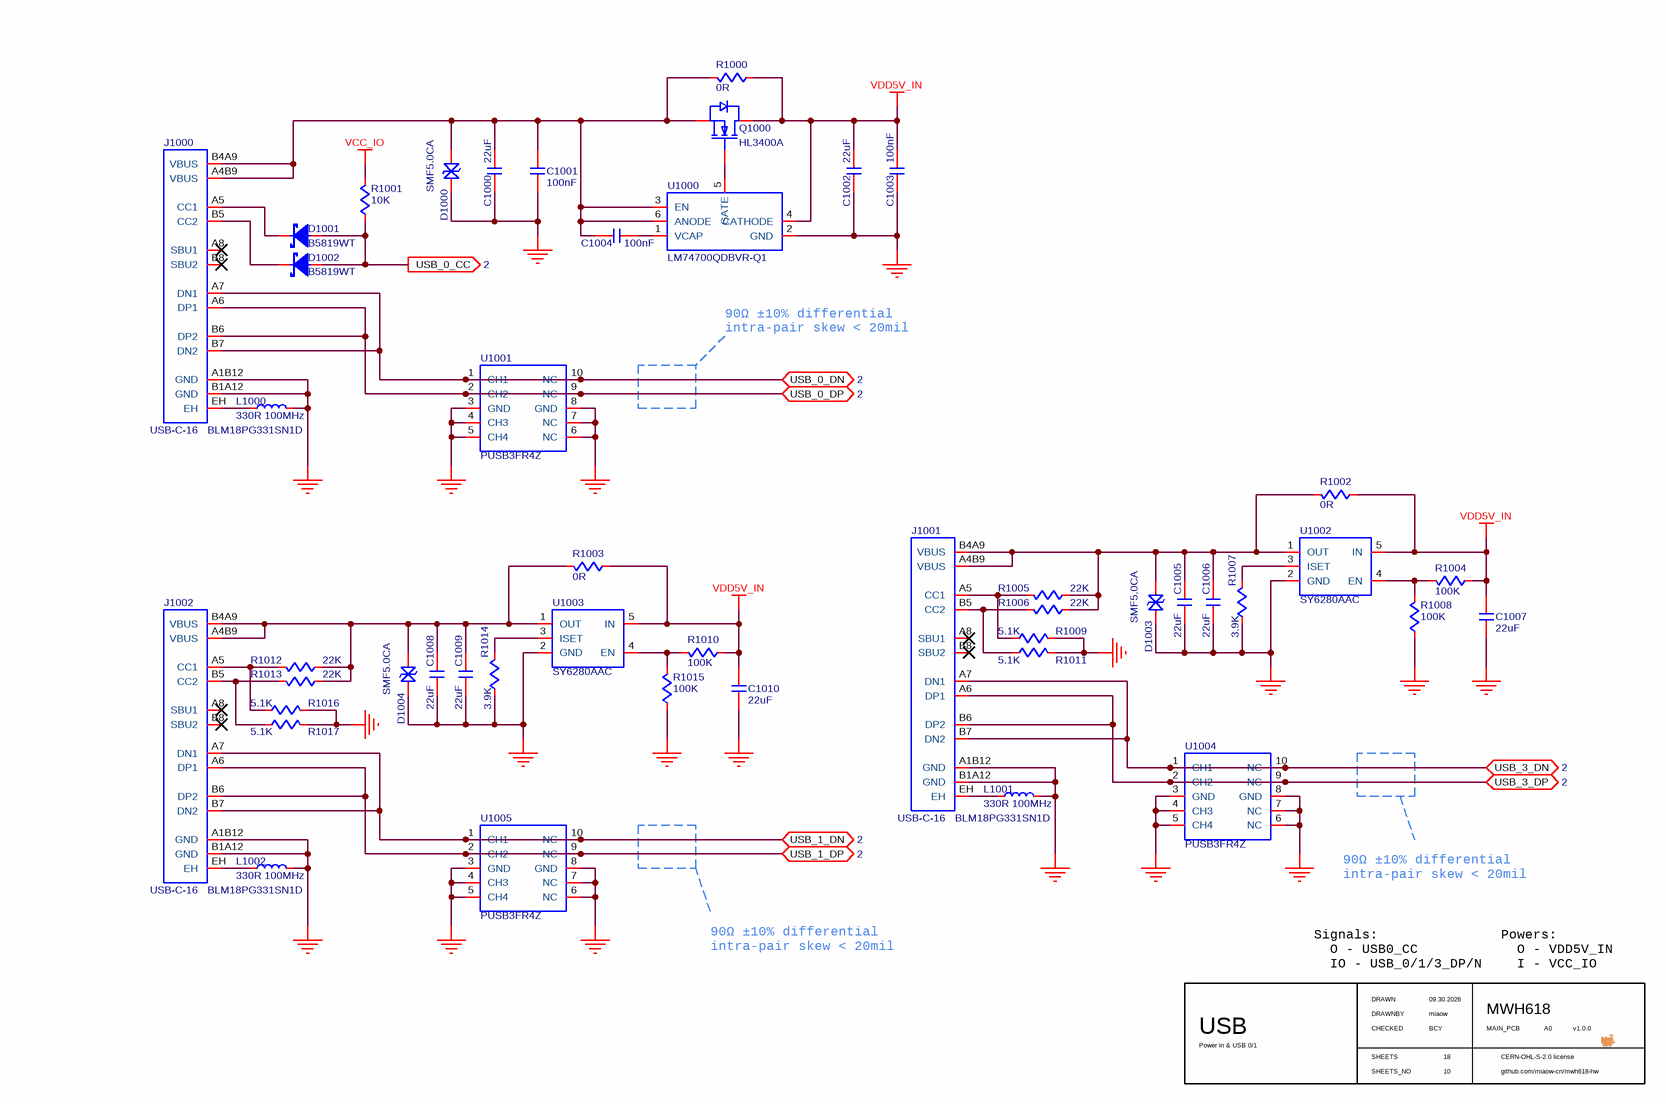
[diagram p7: usb.schdoc]

### Parts
C1000  value 22uF  [C0603]  (hidden comment: C-NOMO)
C1001  value 100nF  [C0402]  (hidden comment: C-NOMO)
C1002  value 22uF  [C0603]  (hidden comment: C-NOMO)
C1003  value 100nF  [C0402]  (hidden comment: C-NOMO)
C1004  value 100nF  [C0402]  (hidden comment: C-NOMO)
C1005  value 22uF  [C0603]  (hidden comment: C-NOMO)
C1006  value 22uF  [C0603]  (hidden comment: C-NOMO)
C1007  value 22uF  [C0603]  (hidden comment: C-NOMO)
C1008  value 22uF  [C0603]  (hidden comment: C-NOMO)
C1009  value 22uF  [C0603]  (hidden comment: C-NOMO)
C1010  value 22uF  [C0603]  (hidden comment: C-NOMO)
D1000  SMF5.0CA  [SMF5.0CA]
D1001  B5819WT  [B5819WT]
D1002  B5819WT  [B5819WT]
D1003  SMF5.0CA  [SMF5.0CA]
D1004  SMF5.0CA  [SMF5.0CA]
J1000  USB-C-16  [USB-C-16]
J1001  USB-C-16  [USB-C-16]
J1002  USB-C-16  [USB-C-16]
L1000  BLM18PG331SN1D  value 330R 100MHz  [L0603]
L1001  BLM18PG331SN1D  value 330R 100MHz  [L0603]
L1002  BLM18PG331SN1D  value 330R 100MHz  [L0603]
Q1000  HL3400A  [HL3400A]
R1000  value 0R  [R1206]  (hidden comment: R)
R1001  value 10K  [R0402]  (hidden comment: R)
R1002  value 0R  [R1206]  (hidden comment: R)
R1003  value 0R  [R1206]  (hidden comment: R)
R1004  value 100K  [R0402]  (hidden comment: R)
R1005  value 22K  [R0402]  (hidden comment: R)
R1006  value 22K  [R0402]  (hidden comment: R)
R1007  value 3.9K  [R0402]  (hidden comment: R)
R1008  value 100K  [R0402]  (hidden comment: R)
R1009  value 5.1K  [R0402]  (hidden comment: R)
R1010  value 100K  [R0402]  (hidden comment: R)
R1011  value 5.1K  [R0402]  (hidden comment: R)
R1012  value 22K  [R0402]  (hidden comment: R)
R1013  value 22K  [R0402]  (hidden comment: R)
R1014  value 3.9K  [R0402]  (hidden comment: R)
R1015  value 100K  [R0402]  (hidden comment: R)
R1016  value 5.1K  [R0402]  (hidden comment: R)
R1017  value 5.1K  [R0402]  (hidden comment: R)
U1000  LM74700QDBVR-Q1  [LM74700QDBVR-Q1]
U1001  PUSB3FR4Z  [PUSB3FR4Z]
U1002  SY6280AAC  [SY6280AAC]
U1003  SY6280AAC  [SY6280AAC]
U1004  PUSB3FR4Z  [PUSB3FR4Z]
U1005  PUSB3FR4Z  [PUSB3FR4Z]

### Ports
USB_0_CC (out, see 2), USB_0_DN (bidir, see 2), USB_0_DP (bidir, see 2), USB_1_DN (bidir, see 2), USB_1_DP (bidir, see 2), USB_3_DN (bidir, see 2), USB_3_DP (bidir, see 2)

### Nets
GND: C1000.1 C1001.2 C1002.1 C1003.2 C1005.1 C1006.1 C1007.2 C1008.1 C1009.1 C1010.2 D1000.1 D1003.1 D1004.1 J1000.A1B12(GND) J1000.B1A12(GND) J1001.A1B12(GND) J1001.B1A12(GND) J1002.A1B12(GND) J1002.B1A12(GND) L1000.2 L1001.2 L1002.2 R1007.2 R1008.2 R1009.1 R1011.1 R1014.2 R1015.2 R1016.1 R1017.1 U1000.2(GND) U1001.3(GND) U1001.4(CH3) U1001.5(CH4) U1001.6(NC) U1001.7(NC) U1001.8(GND) U1002.2(GND) U1003.2(GND) U1004.3(GND) U1004.4(CH3) U1004.5(CH4) U1004.6(NC) U1004.7(NC) U1004.8(GND) U1005.3(GND) U1005.4(CH3) U1005.5(CH4) U1005.6(NC) U1005.7(NC) U1005.8(GND)
VCC_IO: R1001.1  [project net VCC3V3_DLDO]
VDD5V_IN: C1002.2 C1003.1 C1007.1 C1010.1 Q1000.D R1000.2 R1002.2 R1003.2 R1004.2 R1010.2 U1000.4(CATHODE) U1002.5(IN) U1003.5(IN)
USB0_D_N: J1000.A7(DN1) J1000.B7(DN2) U1001.1(CH1) U1001.10(NC) ; port USB_0_DN
USB0_D_P: J1000.A6(DP1) J1000.B6(DP2) U1001.2(CH2) U1001.9(NC) ; port USB_0_DP
USB1_D_N: J1002.A7(DN1) J1002.B7(DN2) U1005.1(CH1) U1005.10(NC) ; port USB_1_DN
USB1_D_P: J1002.A6(DP1) J1002.B6(DP2) U1005.2(CH2) U1005.9(NC) ; port USB_1_DP
USB3_D_N: J1001.A7(DN1) J1001.B7(DN2) U1004.1(CH1) U1004.10(NC) ; port USB_3_DN
USB3_D_P: J1001.A6(DP1) J1001.B6(DP2) U1004.2(CH2) U1004.9(NC) ; port USB_3_DP
USB_0_CC: D1001.2 D1002.2 R1001.2 ; port USB_0_CC
NetC1000_2: C1000.2 C1001.1 C1004.2 D1000.2 J1000.A4B9(VBUS) J1000.B4A9(VBUS) Q1000.S R1000.1 U1000.3(EN) U1000.6(ANODE)
NetC1004_1: C1004.1 U1000.1(VCAP)
NetC1005_2: C1005.2 C1006.2 D1003.2 J1001.A4B9(VBUS) J1001.B4A9(VBUS) R1002.1 R1005.2 R1006.2 U1002.1(OUT)
NetC1008_2: C1008.2 C1009.2 D1004.2 J1002.A4B9(VBUS) J1002.B4A9(VBUS) R1003.1 R1012.2 R1013.2 U1003.1(OUT)
NetD1001_1: D1001.1 J1000.A5(CC1)
NetD1002_1: D1002.1 J1000.B5(CC2)
NetJ1000_EH: J1000.EH L1000.1
NetJ1001_A5: J1001.A5(CC1) R1005.1 R1009.2
NetJ1001_B5: J1001.B5(CC2) R1006.1 R1011.2
NetJ1001_EH: J1001.EH L1001.1
NetJ1002_A5: J1002.A5(CC1) R1012.1 R1016.2
NetJ1002_B5: J1002.B5(CC2) R1013.1 R1017.2
NetJ1002_EH: J1002.EH L1002.1
NetQ1000_G: Q1000.G U1000.5(GATE)
NetR1004_1: R1004.1 R1008.1 U1002.4(EN)
NetR1007_1: R1007.1 U1002.3(ISET)
NetR1010_1: R1010.1 R1015.1 U1003.4(EN)
NetR1014_1: R1014.1 U1003.3(ISET)

Not connected (* = marked no-connect by the designer): J1000 A8(SBU1)* B8(SBU2)*; J1001 A8(SBU1)* B8(SBU2)*; J1002 A8(SBU1)* B8(SBU2)*

### Notes on the sheet
- 90Ω ±10% differential
- intra-pair skew < 20mil
- Signals:
  O - USB0_CC
  IO - USB_0/1/3_DP/N
- Powers:
  O - VDD5V_IN
  I - VCC_IO
- DRAWN
- CHECKED
- DRAWNBY
- SHEETS
- SHEETS_NO

### Library data of the parts
C1000 C1002 C1005-C1010 = C-NOMO: voltage: 10V; precision: 20%; Supplier 1: LCSC; Supplier Part Number 1: C2980159
C1001 C1003 C1004 = C-NOMO: voltage: 50V; precision: 10%; Supplier 1: LCSC; Supplier Part Number 1: C307331
D1000 D1003 D1004 = SMF5.0CA: TVS/ESD; Supplier 1: LCSC; Supplier Part Number 1: C19077498
D1001 D1002 = B5819WT: SCHOTTKY; Supplier 1: LCSC; Supplier Part Number 1: C7502714
L1000-L1002 = L: Code_IEC: 1005; Published: 8-Jun-2000; LatestRevisionDate: 29-May-2009; LatestRevisionNote: IPC-7351 Footprint Added.; PackageReference: 0402-A; Publisher: Altium Limited; PackageDescription: Chip Inductor; Code_JEITA: 0402; Supplier 1: LCSC; Supplier Part Number 1: C79913
Q1000 = HL3400A: NMOS; Supplier 1: LCSC; Supplier Part Number 1: C7420348
R1000 R1002 R1003 = R: precision: 30mR; Supplier 1: LCSC; Supplier Part Number 1: C2907363
R1001 R1004-R1017 = R: precision: 1%; Supplier 1: LCSC
  R1001: Supplier Part Number 1: C25744
  R1004 R1008 R1010 R1015: Supplier Part Number 1: C25741
  R1005 R1006 R1012 R1013: Supplier Part Number 1: C25768
  R1007 R1014: Supplier Part Number 1: C51721
  R1009 R1011 R1016 R1017: Supplier Part Number 1: C25905
U1000 = LM74700QDBVR-Q1: IDEAL DIODE; Supplier Part Number 1: C2941042; Supplier 1: LCSC
U1001 U1004 U1005 = PUSB3FR4Z: TVS/ESD - USB, HDMI; Supplier 1: LCSC; Supplier Part Number 1: C503418
U1002 U1003 = SY6280AAC: PWR SWITCH; Supplier 1: LCSC; Supplier Part Number 1: C55136
J1000-J1002 = USB-C-16: Supplier 1: LCSC; Supplier Part Number 1: C165948